# EAGLE board BasePCB (EAGLE 9.6.2)
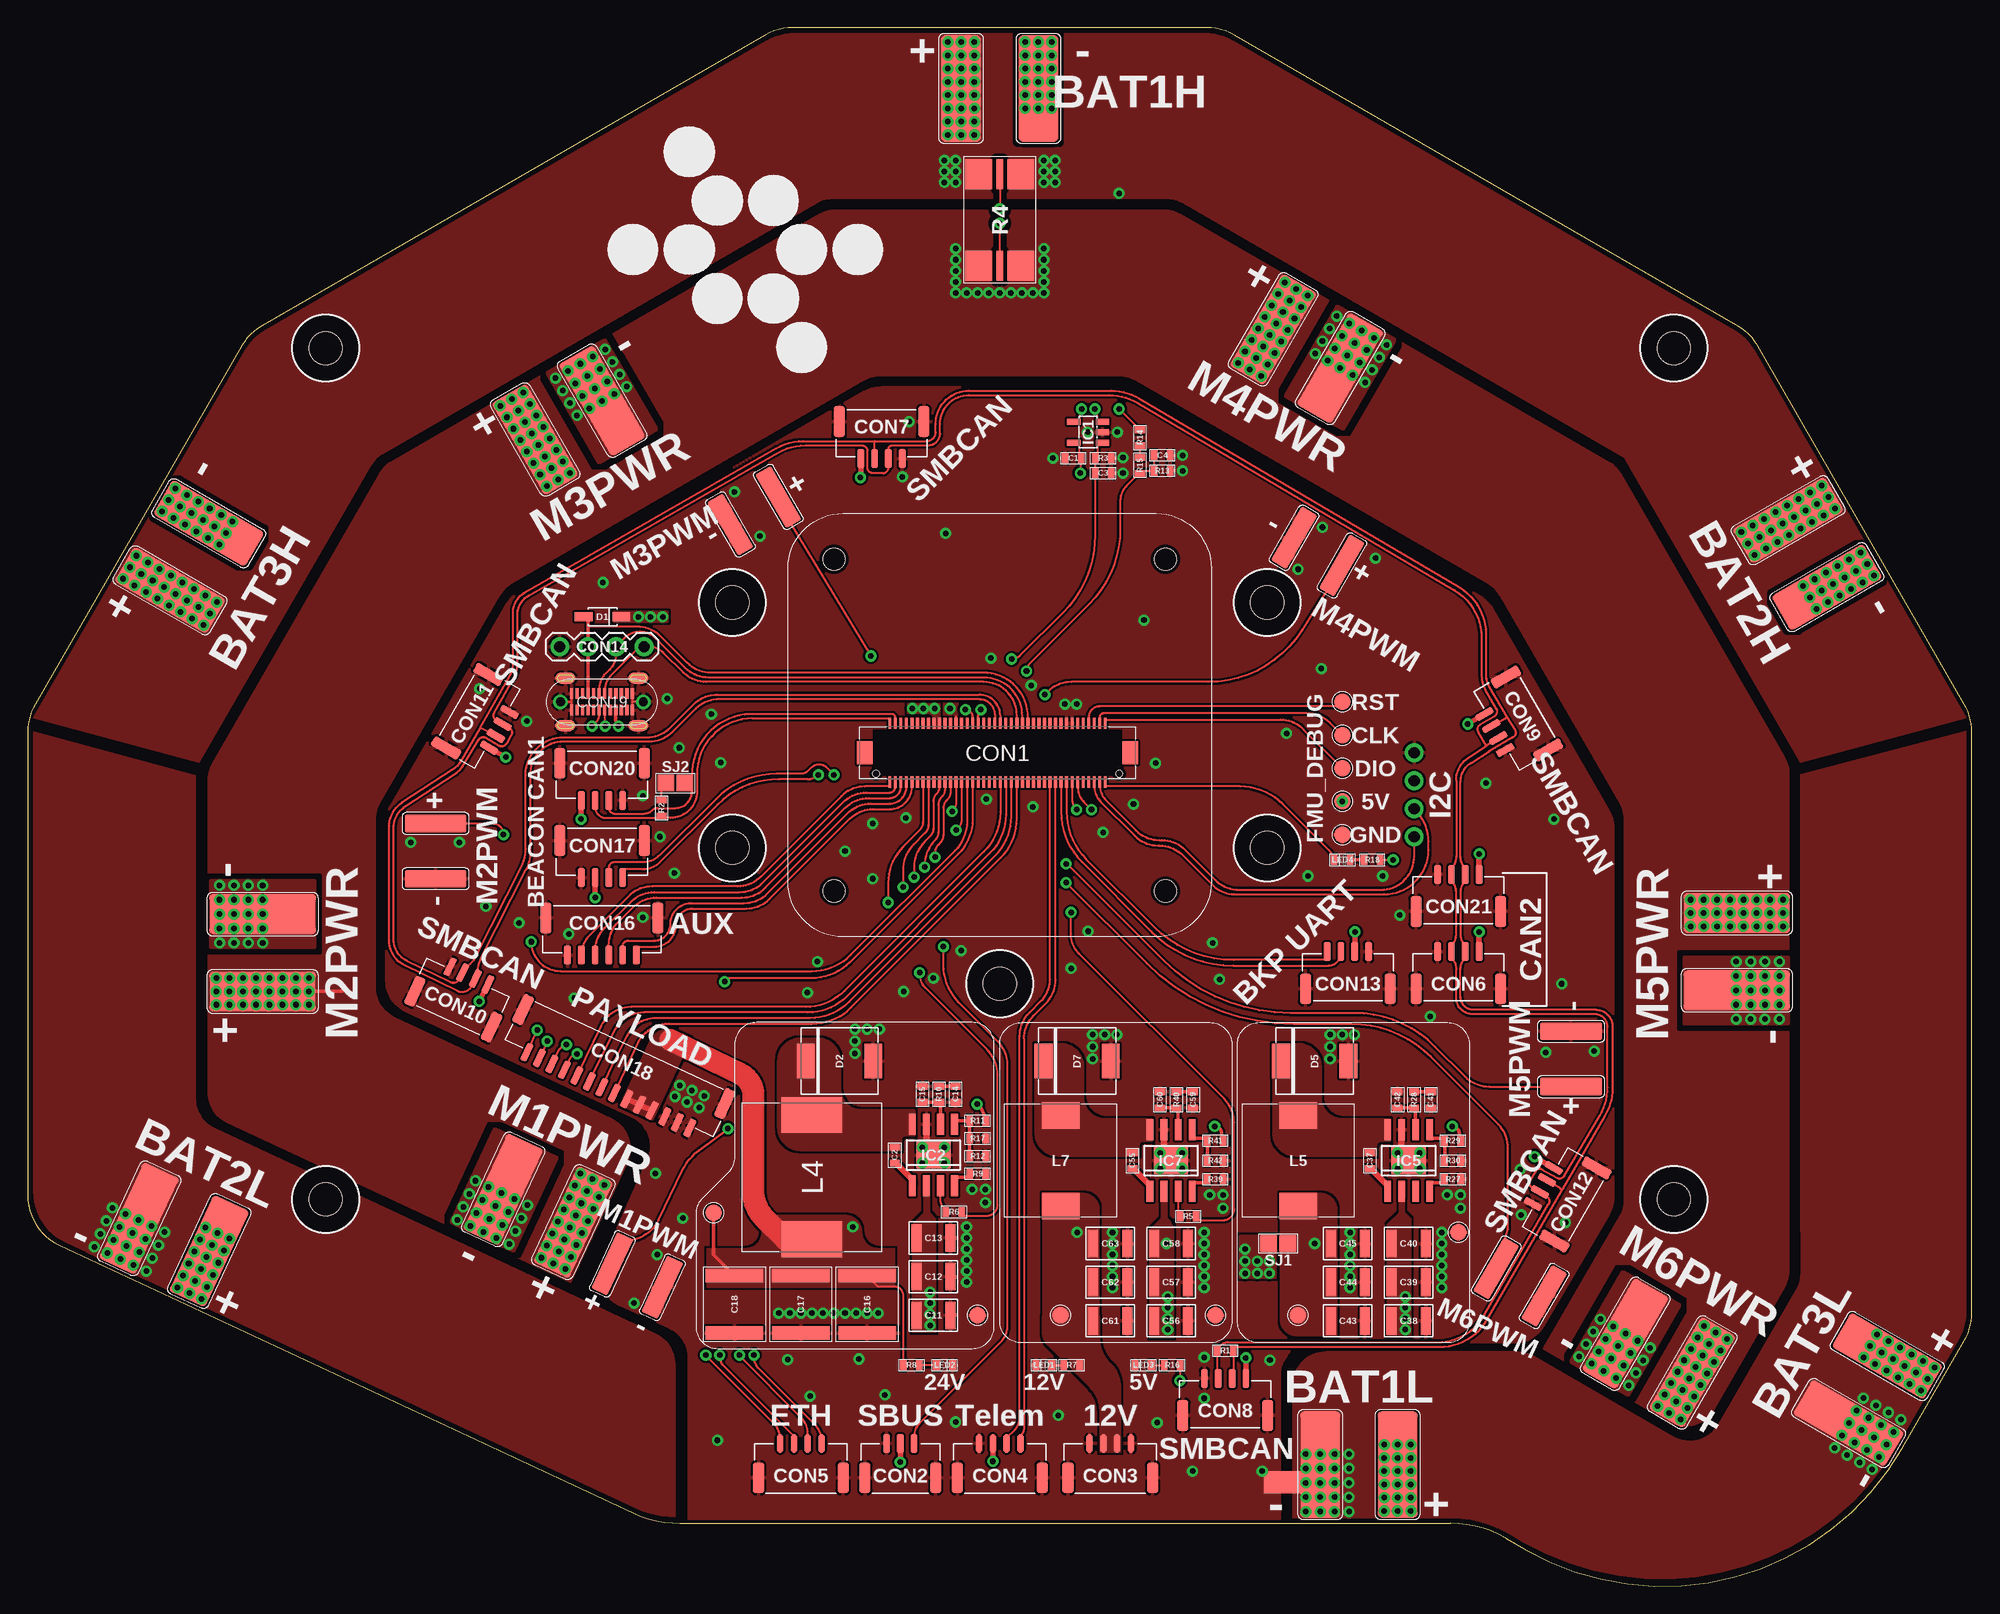
[diagram p3: board, top side]
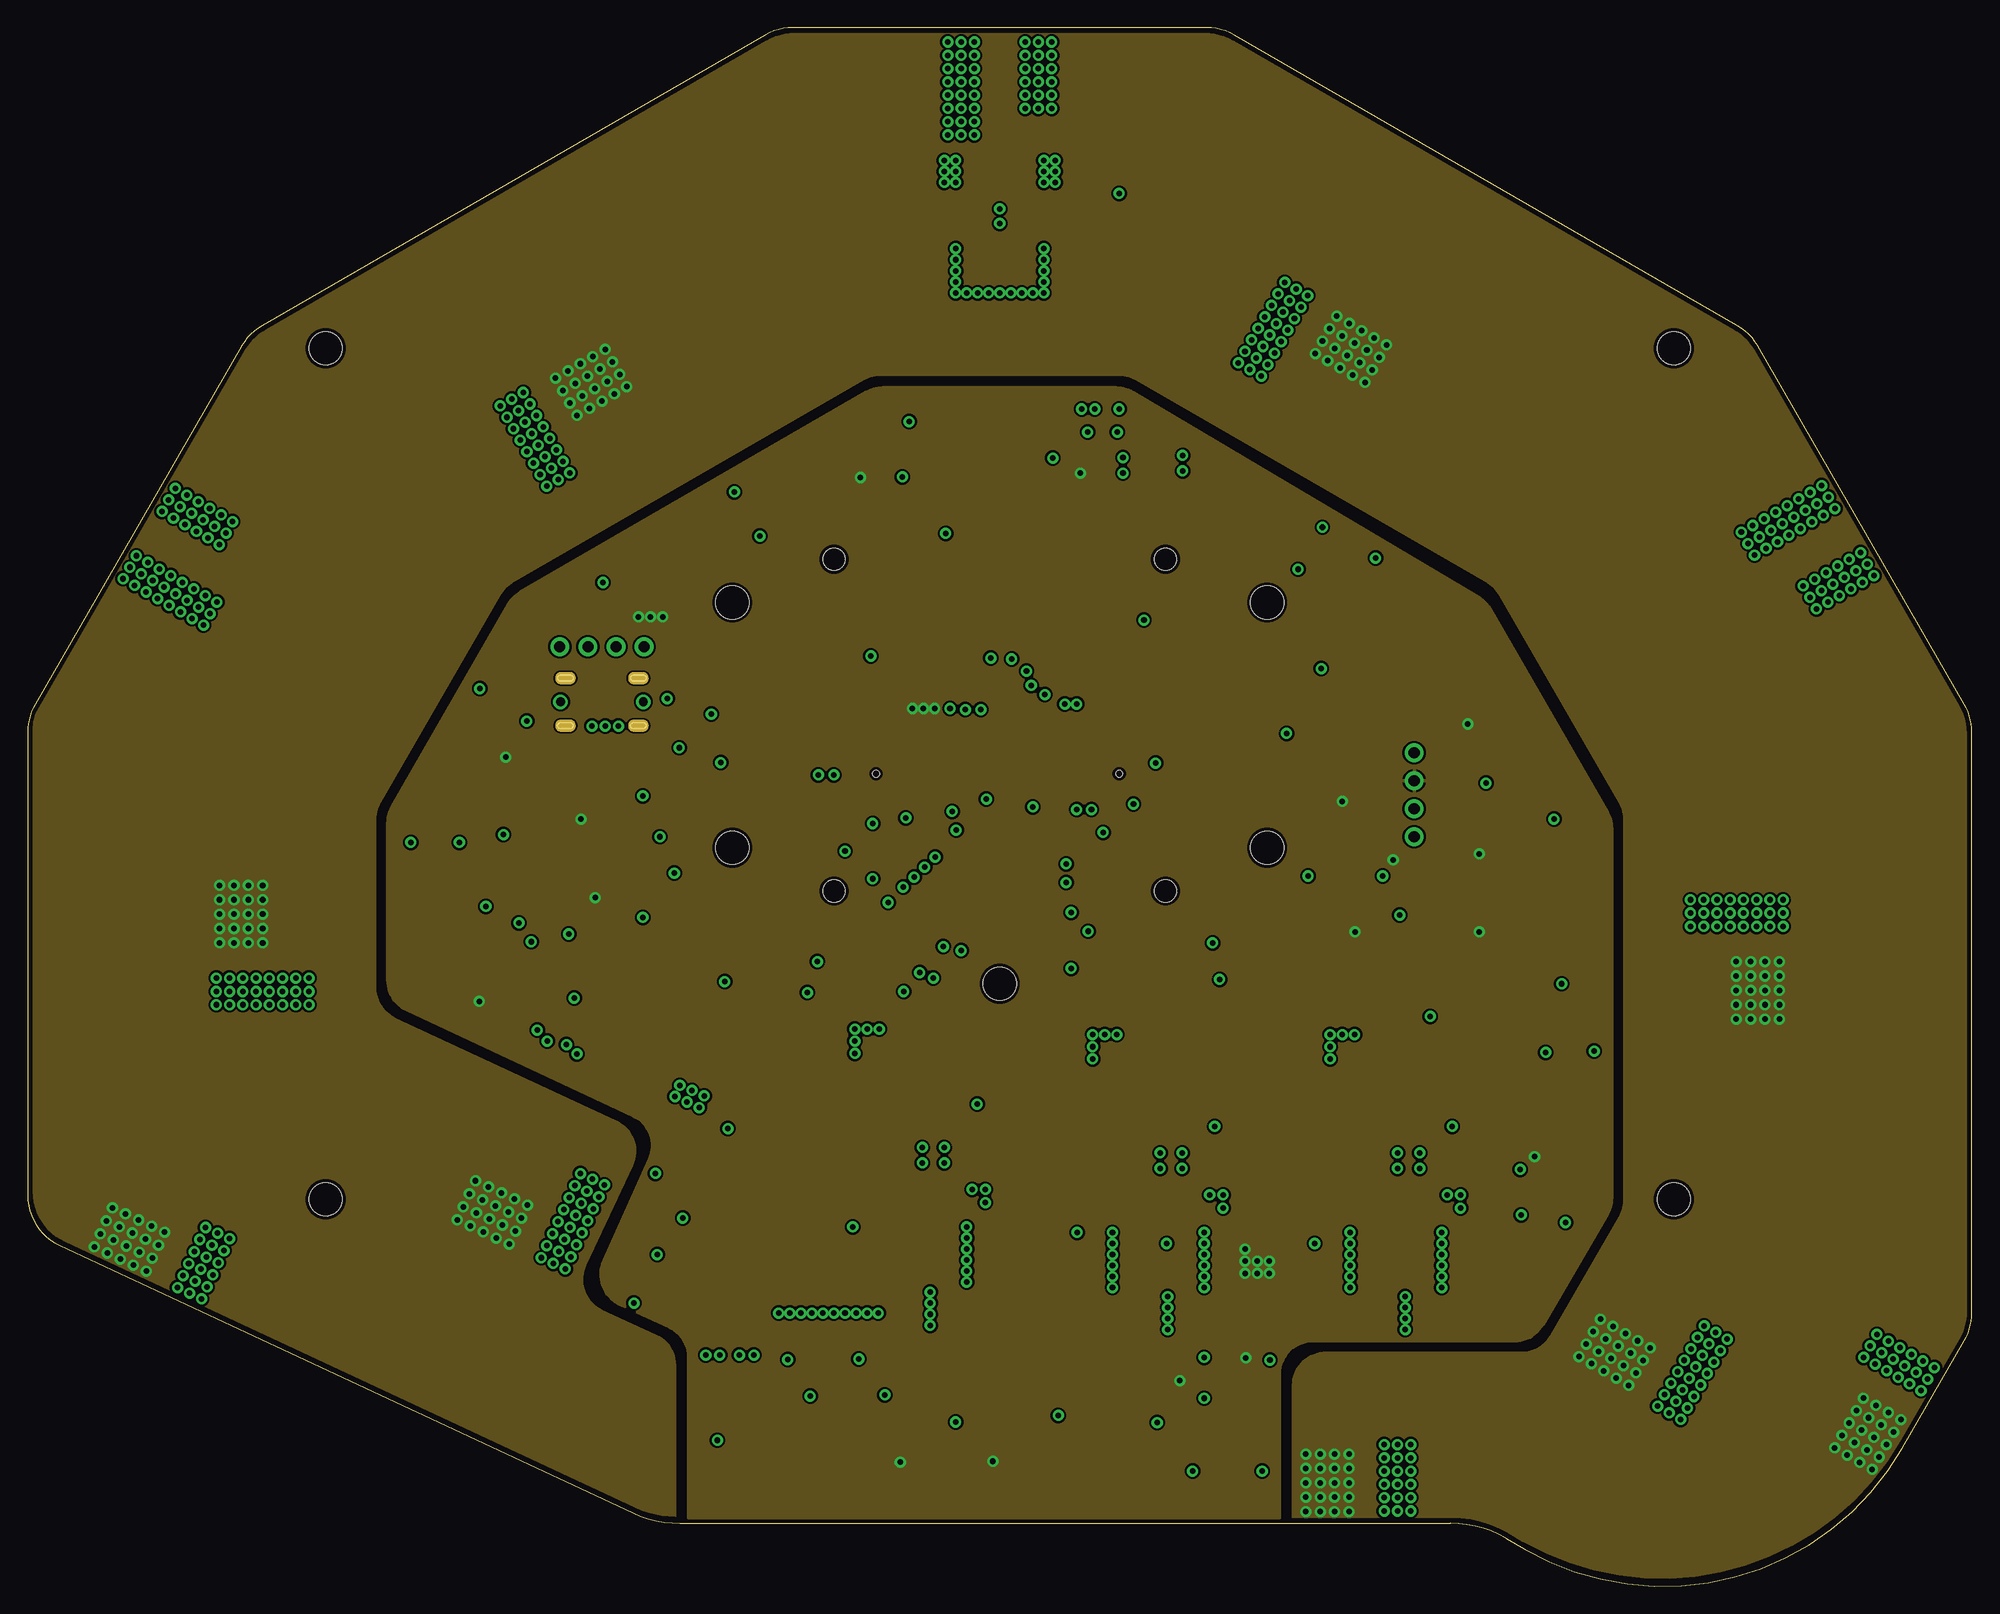
[diagram p4: board, inner layer Route2]
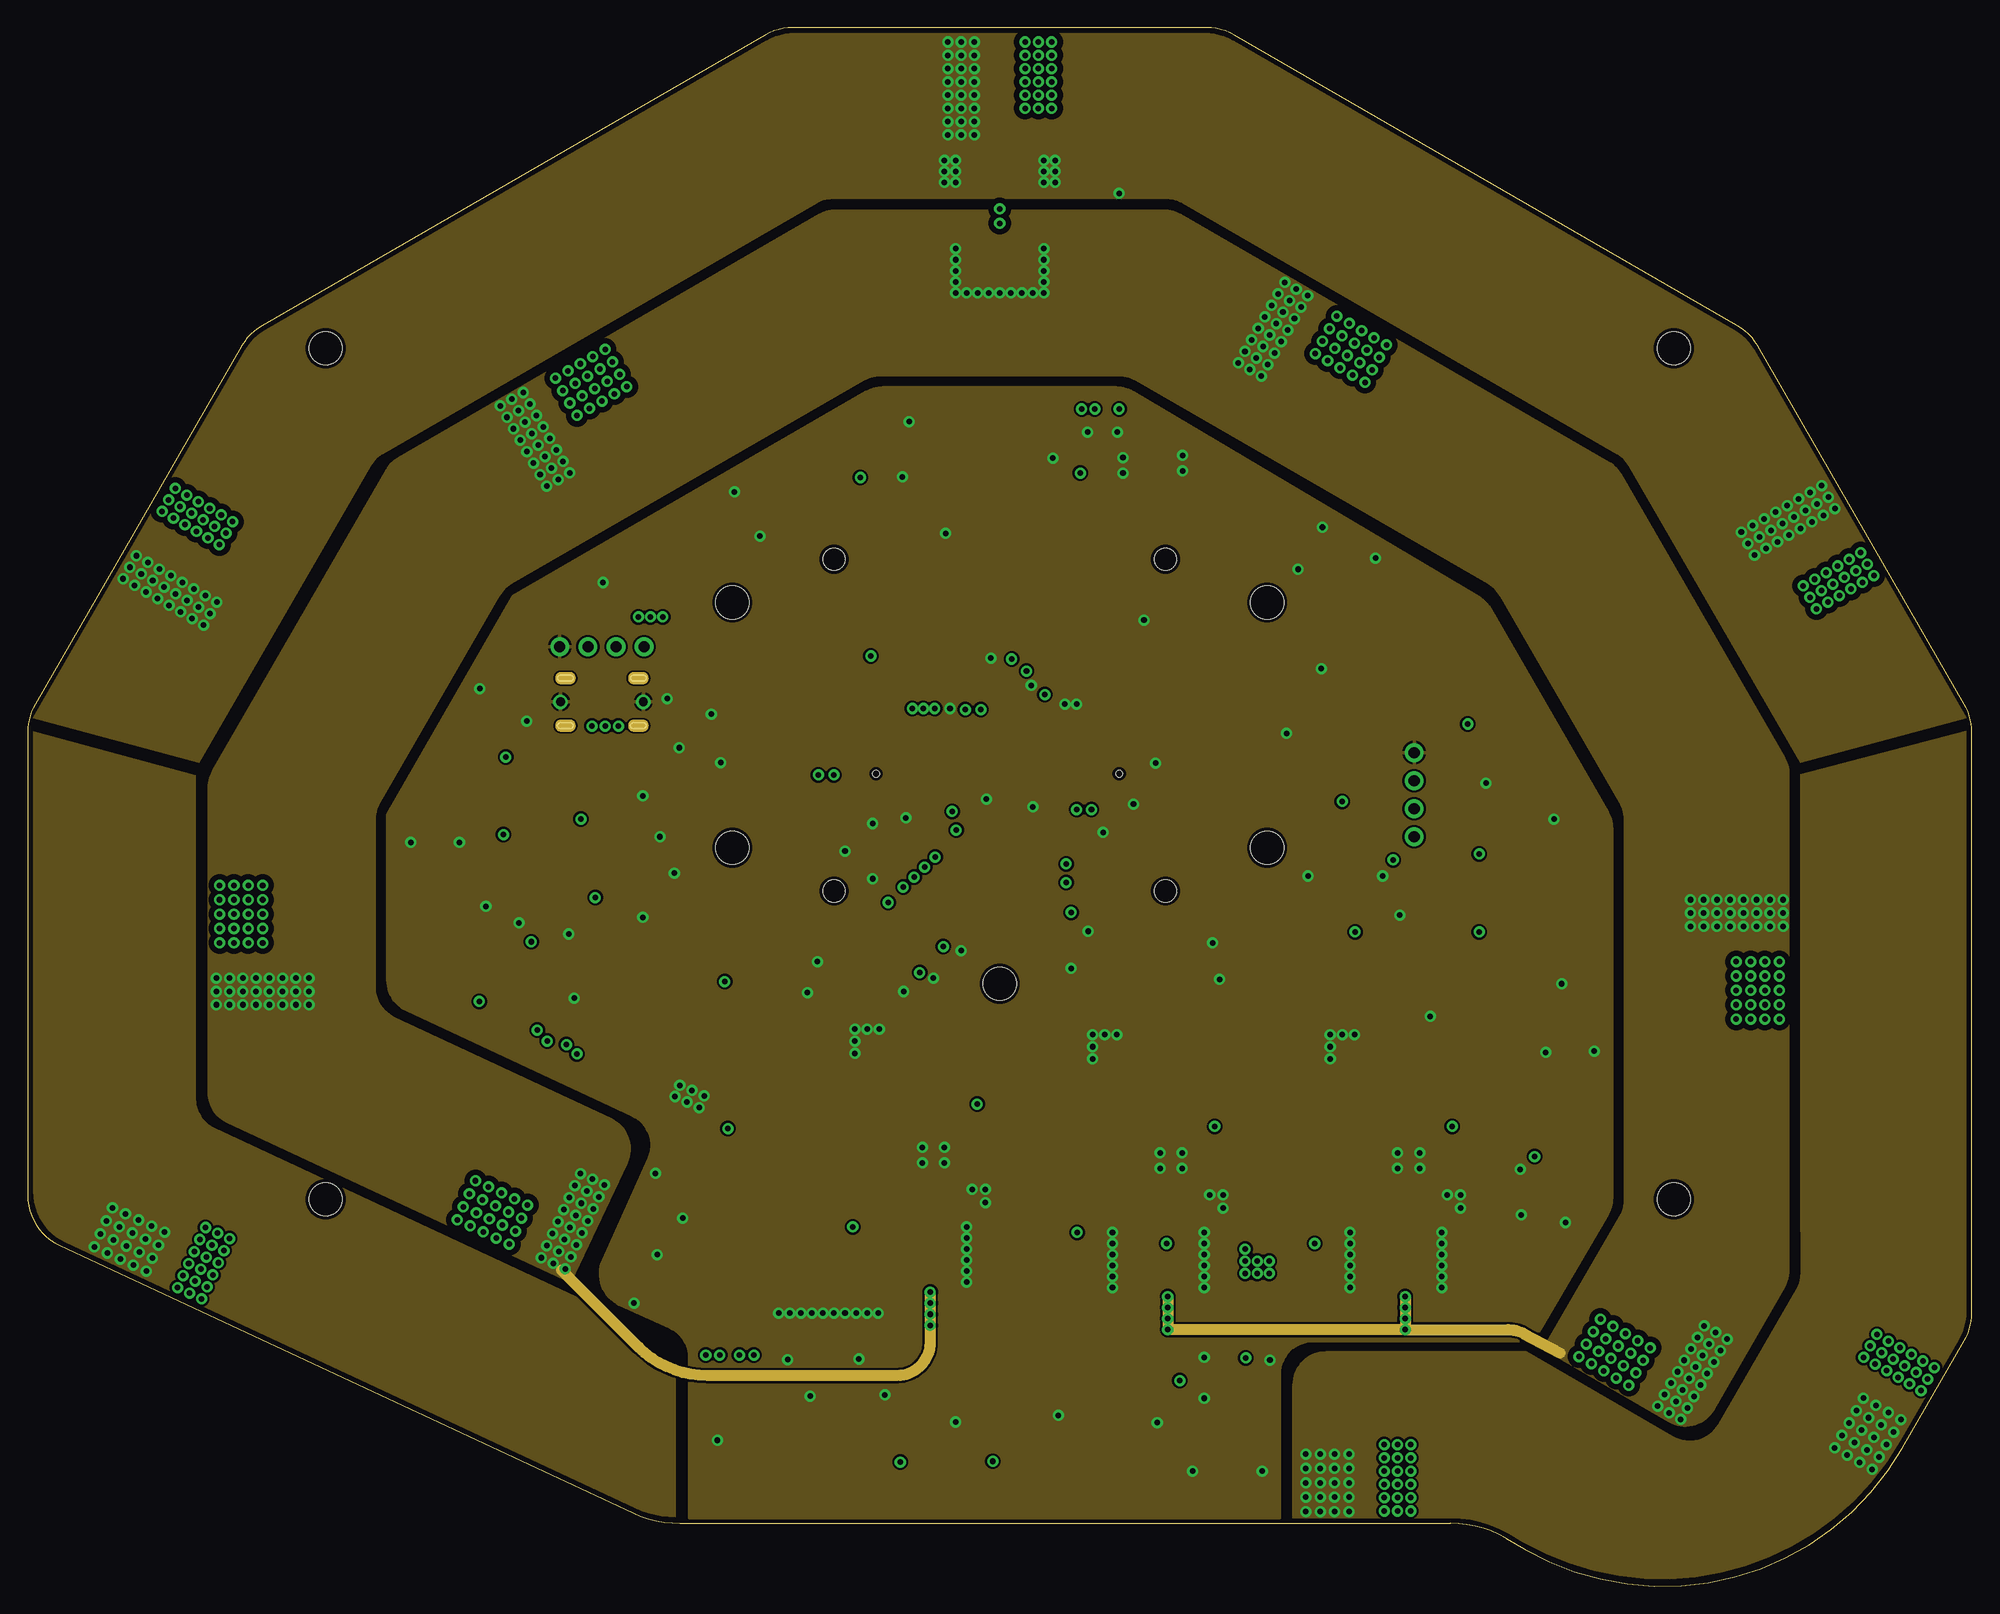
[diagram p5: board, inner layer Route3]
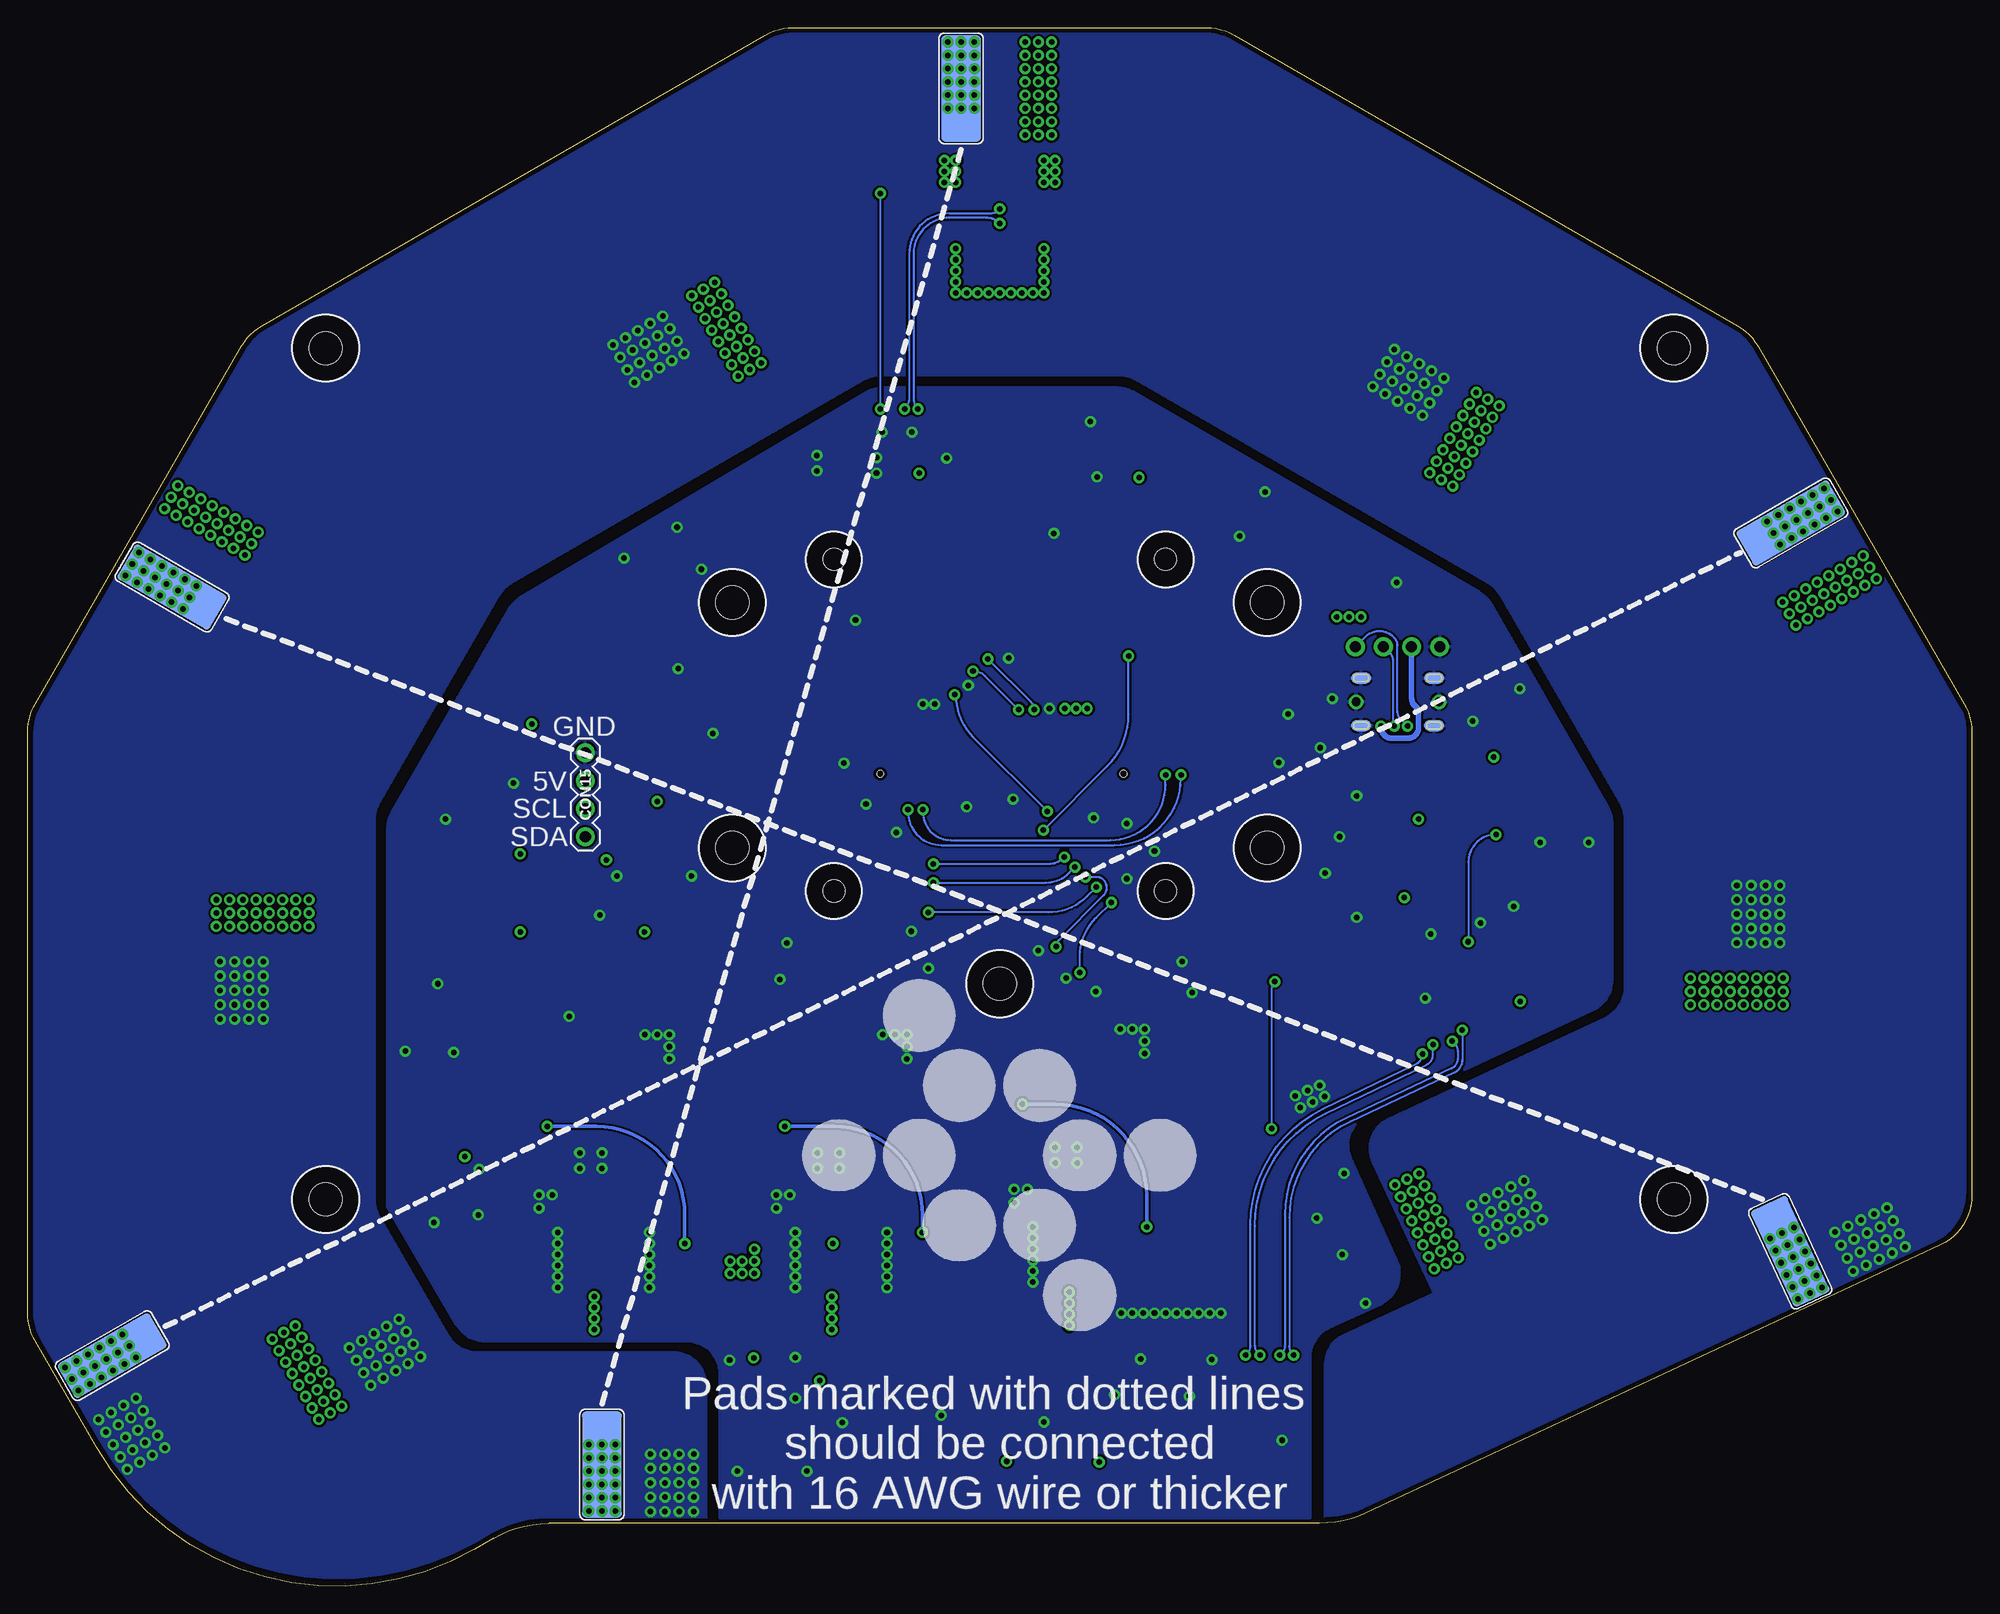
[diagram p6: board, bottom side, seen from below]

Size 175.94 x 140.99 mm. Coordinates in mm from the lower left corner, seen from the top.
Outline: 133.77,4.34 135.51,3.34 arc90 169.66,12.49 175.27,22.2 arc30 175.94,24.7 175.94,77.28 arc30 175.27,79.78 156.55,112.2 arc30 154.72,114.03 109.19,140.32 arc30 106.69,140.99 69.25,140.99 arc30 66.75,140.32 21.22,114.03 arc30 19.39,112.2 0.67,79.78 arc30 0,77.28 0,35.36 arc65 2.89,30.82 54.8,6.62 arc25 59.03,5.68 128.77,5.68 arc-30 133.77,4.34
Copper layers (1+2*3+16): Top 0.035mm / dielectric 0.12mm / Route2 0.035mm / dielectric 1.2mm / Route3 0.035mm / dielectric 0.2mm / Bottom 0.035mm
Design rules "JLCPCB 4 layer_0.2 *": minimum track width 0.2mm, minimum drill 0.2mm, track to track 0.2mm, track to pad 0.2mm, pad to pad 0.2mm, via to via 0.2mm, smd to smd 0.15mm, copper to edge 0.3mm, drill to drill 0.2mm, minimum pad ring 0.125mm, minimum via ring 0.125mm, stop-mask expansion 1mil, vias tented up to drill 0.5mm, thermal gap 8mil
Net classes: 1 HV: clearance 0.5 mm to class 0, clearance 0.5 mm
Holes 3 mm at 63.77,88.99 112.17,88.99 112.17,66.79 63.77,66.79 148.97,111.99 26.97,111.99 26.97,34.99 87.97,54.49 148.97,34.99
Holes 2 mm at 72.97,62.89 102.97,62.89 102.97,92.89 72.97,92.89
tRestrict: area 85,51.5 to 91,57.5; area 24,32 to 30,38; area 146,32 to 152,38; area 60.8,86 to 66.8,92; area 109.2,86 to 115.2,92; area 60.8,63.8 to 66.8,69.8; area 109.2,63.8 to 115.2,69.8; area 146,109 to 152,115; area 24,109 to 30,115; 3 lines
bRestrict: area 24,109 to 30,115; area 24,32 to 30,38; area 146,32 to 152,38; area 146,109 to 152,115; area 109.2,86 to 115.2,92; area 109.2,63.8 to 115.2,69.8; area 60.8,63.8 to 66.8,69.8; area 60.8,86 to 66.8,92; area 85,51.5 to 91,57.5; area 70.5,90.4 to 75.5,95.4; area 100.5,90.4 to 105.5,95.4; area 100.5,60.4 to 105.5,65.4; area 70.5,60.4 to 75.5,65.4

## Footprints (pad centres in the part's own frame; a part is rotated, then mirrored left to right if it is on the bottom)
4X10_PAIR = smd 3.6 x 9.6: 1 -3.5,0; 2 3.5,0
C0603 = smd 0.6 x 0.9: 1 -0.725,0; 2 0.725,0
C1210 = smd 0.9 x 2.5: 1 -1.55,0; 2 1.55,0
C2220 = smd 1.2 x 5.2: P$1 -2.6,0; P$2 2.6,0
DF17(1.0H)-80DP-0.5V = smd 1 x 0.25: 1 -2.65,9.75; 2 2.65,9.75; 3 -2.65,9.25; 4 2.65,9.25; 5 -2.65,8.75; 6 2.65,8.75; 7 -2.65,8.25; 8 2.65,8.25; 9 -2.65,7.75; 10 2.65,7.75; 11 -2.65,7.25; 12 2.65,7.25; 13 -2.65,6.75; 14 2.65,6.75; 15 -2.65,6.25; 16 2.65,6.25; 17 -2.65,5.75; 18 2.65,5.75; 19 -2.65,5.25; 20 2.65,5.25; 21 -2.65,4.75; 22 2.65,4.75; 23 -2.65,4.25; 24 2.65,4.25; 25 -2.65,3.75; 26 2.65,3.75; 27 -2.65,3.25; 28 2.65,3.25; 29 -2.65,2.75; 30 2.65,2.75; 31 -2.65,2.25; 32 2.65,2.25; 33 -2.65,1.75; 34 2.65,1.75; 35 -2.65,1.25; 36 2.65,1.25; 37 -2.65,0.75; 38 2.65,0.75; 39 -2.65,0.25; 40 2.65,0.25; 41 -2.65,-0.25; 42 2.65,-0.25; 43 -2.65,-0.75; 44 2.65,-0.75; 45 -2.65,-1.25; 46 2.65,-1.25; 47 -2.65,-1.75; 48 2.65,-1.75; 49 -2.65,-2.25; 50 2.65,-2.25; 51 -2.65,-2.75; 52 2.65,-2.75; 53 -2.65,-3.25; 54 2.65,-3.25; 55 -2.65,-3.75; 56 2.65,-3.75; 57 -2.65,-4.25; 58 2.65,-4.25; 59 -2.65,-4.75; 60 2.65,-4.75; 61 -2.65,-5.25; 62 2.65,-5.25; 63 -2.65,-5.75; 64 2.65,-5.75; 65 -2.65,-6.25; 66 2.65,-6.25; 67 -2.65,-6.75; 68 2.65,-6.75; 69 -2.65,-7.25; 70 2.65,-7.25; 71 -2.65,-7.75; 72 2.65,-7.75; 73 -2.65,-8.25; 74 2.65,-8.25; 75 -2.65,-8.75; 76 2.65,-8.75; 77 -2.65,-9.25; 78 2.65,-9.25; 79 -2.65,-9.75; 80 2.65,-9.75 | smd 2.1 x 1.4: P1 0,-12; P2 0,12 | hole 0.6: 1.9,-11; 1.9,11
SM03B-GHS-TB = smd 0.6 x 1.7: 1 1.25,-2.91; 2 0,-2.91; 3 -1.25,-2.91 | smd 1 x 2.8: M$0 -3.2,0.19; M$1 3.2,0.19
SM04B-GHS-TB = smd 0.6 x 1.7: 1 1.875,-2.91; 2 0.625,-2.91; 3 -0.625,-2.91; 4 -1.875,-2.91 | smd 1 x 2.8: M$0 -3.825,0.19; M$1 3.825,0.19
BM04B-GHS-TB = smd 0.6 x 1.7: 1 -1.875,-2.9; 2 -0.625,-2.9; 3 0.625,-2.9; 4 1.875,-2.9 | smd 1 x 2.8: M$0 -3.825,0.45; M$1 3.825,0.45
1X04-PTH-2.54 = drill 1 pad 1.7: 1 -3.81,0; 2 -1.27,0; 3 1.27,0; 4 3.81,0
BM06B-GHS-TBT = smd 0.6 x 1.7: 1 -3.125,-2.9; 2 -1.875,-2.9; 3 -0.625,-2.9; 4 0.625,-2.9; 5 1.875,-2.9; 6 3.125,-2.9 | smd 1 x 2.8: M$0 -5.075,0.45; M$1 5.075,0.45
BM14B-GHS-TBT = smd 0.6 x 1.7: 1 -8.125,-2.9; 2 -6.875,-2.9; 3 -5.625,-2.9; 4 -4.375,-2.9; 5 -3.125,-2.9; 6 -1.875,-2.9; 7 -0.625,-2.9; 8 0.625,-2.9; 9 1.875,-2.9; 10 3.125,-2.9; 11 4.375,-2.9; 12 5.625,-2.9; 13 6.875,-2.9; 14 8.125,-2.9 | smd 1 x 2.8: M$0 -10.075,0.45; M$1 10.075,0.45
2047110001-PROD = smd 0.3 x 0.95: A1 -2.75,0.755; A2 -2.25,0.755; A3 -1.75,0.755; A4 -1.25,0.755; A5 -0.75,0.755; A6 -0.25,0.755; A7 0.25,0.755; A8 0.75,0.755; A9 1.25,0.755; A10 1.75,0.755; A11 2.25,0.755; A12 2.75,0.755; B1 2.75,-0.755; B2 2.25,-0.755; B3 1.75,-0.755; B4 1.25,-0.755; B5 0.75,-0.755; B6 0.25,-0.755; B7 -0.25,-0.755; B8 -0.75,-0.755; B9 -1.25,-0.755; B10 -1.75,-0.755; B11 -2.25,-0.755; B12 -2.75,-0.755 | smd 1.8 x 1: G1 -3.3,2.15; G4 3.3,2.15; G7 -3.3,-2.15; G9 3.3,-2.15 | smd 1.8 x 1 bottom: G2 -3.3,2.15; G5 3.3,2.15; G8 -3.3,-2.15; G10 3.3,-2.15 | drill 0.8 pad 1.3: P$1 -3.75,0; P$2 3.75,0
SOD123 = smd 1.6 x 0.8: A -1.7,0; C 1.7,0
DO-214AB(SMC) = smd 1.6 x 3.1: A 3.05,0; C -3.05,0
SOT23-5 = smd 1.2 x 0.55: 1 1.3,-0.95; 2 1.3,0; 3 1.3,0.95; 4 -1.3,0.95; 5 -1.3,-0.95
SOIC8-POWERPAD = smd 0.6 x 1.9: 1 -1.905,-2.78; 2 -0.635,-2.78; 3 0.635,-2.78; 4 1.905,-2.78; 5 1.905,2.78; 6 0.635,2.78; 7 -0.635,2.78; 8 -1.905,2.78 | smd 3.1 x 2.4: P$1 0,0
CONNECTION_BIG = smd 2 x 2: 1 -1,0; 2 1,0
MWSA1206S = smd 3.25 x 5.5: 1 -5.625,0; 2 5.625,0
1064 = smd 3.4 x 2.4: 1 0,-4.1; 2 0,4.1
LED0603 = smd 0.6 x 0.9: A 0.725,0; C -0.725,0
10X4 = smd 3.6 x 9.6: P$1 0,0
2х2 = smd 1.5 x 1.5: P$1 0,0
2X6_PAIR = smd 1.6 x 5.6: 1 -2.5,0; 2 2.5,0
R0603 = smd 0.6 x 0.9: 1 -0.725,0; 2 0.725,0
R3920-KELVIN = smd 2.7 x 2.4: 1 -4.15,1.9; 2 4.15,1.9; 11 -4.15,-1.9; 22 4.15,-1.9 | smd 2.7 x 0.6: S1 -4.15,0; S2 4.15,0
RES_0 = smd 1.5 x 1.5: 1 -0.85,0; 2 0.85,0

## Placement (x,y rotation side)
BAT1PAD1  PAD_PAIR-4X10  [4X10_PAIR]  87.97,135.49 0 top
BAT1PAD2  PAD_PAIR-4X10  [4X10_PAIR]  120.47,10.99 180 top
BAT2PAD1  PAD_PAIR-4X10  [4X10_PAIR]  161.06,93.4 300 top
BAT2PAD2  PAD_PAIR-4X10  [4X10_PAIR]  13.27,31.79 155 top
BAT3PAD1  PAD_PAIR-4X10  [4X10_PAIR]  14.64,93.12 60 top
BAT3PAD2  PAD_PAIR-4X10  [4X10_PAIR]  166.53,17.78 240 top
C1  0.1uF  [C0603]  94.62,102.04 0 top
C2  0.1uF  [C0603]  78.47,38.99 90 top
C3  DNP  [C0603]  97.32,100.69 180 top
C4  DNP  [C0603]  102.67,102.29 180 top
C11  2.2uF  [C1210]  81.97,24.49 180 top
C12  2.2uF  [C1210]  81.97,27.99 180 top
C13  2.2uF  [C1210]  81.97,31.49 180 top
C14  4700pF  [C0603]  83.97,44.49 90 top
C15  47pF  [C0603]  80.97,44.49 270 top
C16  22uF  [C2220]  75.97,25.49 90 top
C17  22uF  [C2220]  69.97,25.49 90 top
C18  22uF  [C2220]  63.97,25.49 90 top
C37  0.1uF  [C0603]  121.47,38.49 90 top
C38  2.2uF  [C1210]  124.97,23.99 180 top
C39  2.2uF  [C1210]  124.97,27.49 180 top
C40  2.2uF  [C1210]  124.97,30.99 180 top
C41  4700pF  [C0603]  126.97,43.99 90 top
C42  47pF  [C0603]  123.97,43.99 270 top
C43  47uF  [C1210]  119.47,23.99 180 top
C44  47uF  [C1210]  119.47,27.49 180 top
C45  47uF  [C1210]  119.47,30.99 180 top
C55  0.1uF  [C0603]  99.97,38.49 90 top
C56  2.2uF  [C1210]  103.47,23.99 180 top
C57  2.2uF  [C1210]  103.47,27.49 180 top
C58  2.2uF  [C1210]  103.47,30.99 180 top
C59  4700pF  [C0603]  105.47,43.99 90 top
C60  47pF  [C0603]  102.47,43.99 270 top
C61  47uF  [C1210]  97.97,23.99 180 top
C62  47uF  [C1210]  97.97,27.49 180 top
C63  47uF  [C1210]  97.97,30.99 180 top
CON1  CON-80P-DF17(1.0H)-80DP-0.5V  [DF17(1.0H)-80DP-0.5V]  87.77,75.39 270 top
CON2  CON-3P-TABS-JST-GH-SIDE  [SM03B-GHS-TB]  78.97,9.99 180 top
CON3  CON-4P-TABS-JST-GH-SIDE  [SM04B-GHS-TB]  97.97,9.99 180 top
CON4  CON-4P-TABS-JST-GH-SIDE  [SM04B-GHS-TB]  87.97,9.99 180 top
CON5  CON-4P-TABS-JST-GH-SIDE  [SM04B-GHS-TB]  69.97,9.99 180 top
CON6  CON-4P-TABS-JST-GH-TOP  [BM04B-GHS-TB]  129.47,54.49 180 top
CON7  CON-4P-TABS-JST-GH-TOP  [BM04B-GHS-TB]  77.27,104.89 0 top
CON8  CON-4P-TABS-JST-GH-TOP  [BM04B-GHS-TB]  108.37,15.89 180 top
CON9  CON-4P-TABS-JST-GH-TOP  [BM04B-GHS-TB]  135.29,78.71 300 top
CON10  CON-4P-TABS-JST-GH-TOP  [BM04B-GHS-TB]  38.71,52.61 155 top
CON11  CON-4P-TABS-JST-GH-TOP  [BM04B-GHS-TB]  40.17,78.92 60 top
CON12  CON-4P-TABS-JST-GH-TOP  [BM04B-GHS-TB]  139.67,34.74 240 top
CON13  CON-4P-TABS-JST-GH-TOP  [BM04B-GHS-TB]  119.47,54.49 180 top
CON14  PINHEAD_1X04-2.54  [1X04-PTH-2.54]  51.97,84.99 0 top
CON15  PINHEAD_1X04-2.54  [1X04-PTH-2.54]  125.47,71.59 270 bottom
CON16  CON-6P-TABS-JST-GH-TOP  [BM06B-GHS-TBT]  51.97,59.99 0 top
CON17  CON-4P-TABS-JST-GH-TOP  [BM04B-GHS-TB]  51.97,66.99 0 top
CON18  CON-14P-TABS-JST-GH-TOP  [BM14B-GHS-TBT]  53.77,47.49 335 top
CON19  USB-TYPE-C-VERT-PROD  [2047110001-PROD]  51.97,79.99 0 top
CON20  CON-4P-TABS-JST-GH-TOP  [BM04B-GHS-TB]  51.97,73.99 0 top
CON21  CON-4P-TABS-JST-GH-TOP  [BM04B-GHS-TB]  129.47,61.49 180 top
D1  MBR0520L-SOD123  [SOD123]  52.02,87.69 0 top
D2  B560C  [DO-214AB(SMC)]  73.47,47.49 0 top
D5  B560C  [DO-214AB(SMC)]  116.47,47.49 0 top
D7  B560C  [DO-214AB(SMC)]  94.97,47.49 0 top
IC1  INA169  [SOT23-5]  95.97,104.39 0 top
IC2  TPS54560B  [SOIC8-POWERPAD]  81.97,38.99 0 top
IC5  TPS54560B  [SOIC8-POWERPAD]  124.97,38.49 0 top
IC7  TPS54560B  [SOIC8-POWERPAD]  103.47,38.49 0 top
J1  CONNECTION-SMD-BIG  [CONNECTION_BIG]  113.87,9.39 0 top
L4  22µH  [MWSA1206S]  70.97,36.99 270 top
L5  7.2uH  [1064]  114.97,38.49 180 top
L7  7.2uH  [1064]  93.47,38.49 180 top
LED1  LED-0603  [LED0603]  91.97,19.99 0 top
LED2  LED-0603  [LED0603]  82.97,19.99 180 top
LED3  LED-0603  [LED0603]  100.97,19.99 0 top
LED4  LED-0603  [LED0603]  118.97,65.69 0 top
M1  PAD_PAIR-4X10  [4X10_PAIR]  46.21,34.41 155 top
M2  PAD_PAIR-4X10  [4X10_PAIR]  21.27,57.29 90 top
M3  PAD_PAIR-4X10  [4X10_PAIR]  48.96,105.49 30 top
M4  PAD_PAIR-4X10  [4X10_PAIR]  115.74,111.94 330 top
M5  PAD_PAIR-4X10  [4X10_PAIR]  154.67,57.39 270 top
M6  PAD_PAIR-4X10  [4X10_PAIR]  147.61,21.08 150 top
PAD1  PAD-10X4  [10X4]  91.47,135.49 0 bottom
PAD2  PAD-10X4  [10X4]  16.44,30.28 205 bottom
PAD3  PAD-S_2X2  [2х2]  118.97,70.99 0 top
PAD4  PAD-S_2X2  [2х2]  118.97,67.99 0 top
PAD5  PAD-10X4  [10X4]  162.86,90.38 240 bottom
PAD6  PAD-10X4  [10X4]  168.28,20.84 300 bottom
PAD7  PAD-10X4  [10X4]  123.97,10.99 180 bottom
PAD10  PAD-10X4  [10X4]  16.39,96.18 300 bottom
PAD13  PAD-S_2X2  [2х2]  129.47,31.99 90 top
PAD14  PAD-S_2X2  [2х2]  114.97,24.49 90 top
PAD15  PAD-S_2X2  [2х2]  93.47,24.49 90 top
PAD16  PAD-S_2X2  [2х2]  107.47,24.49 180 top
PAD17  PAD-S_2X2  [2х2]  62.07,33.79 180 top
PAD18  PAD-S_2X2  [2х2]  85.97,24.49 90 top
PAD25  PAD-S_2X2  [2х2]  118.97,76.99 180 top
PAD26  PAD-S_2X2  [2х2]  118.97,73.99 180 top
PAD27  PAD-S_2X2  [2х2]  118.97,79.99 180 top
PAD28  PAD_PAIR-2X6  [2X6_PAIR]  55.17,28.09 155 top
PAD29  PAD_PAIR-2X6  [2X6_PAIR]  36.92,66.49 90 top
PAD30  PAD_PAIR-2X6  [2X6_PAIR]  65.77,97.29 30 top
PAD31  PAD_PAIR-2X6  [2X6_PAIR]  116.77,93.59 330 top
PAD32  PAD_PAIR-2X6  [2X6_PAIR]  139.67,47.69 270 top
PAD33  PAD_PAIR-2X6  [2X6_PAIR]  135.07,27.49 150 top
R1  120R  [R0603]  108.37,21.29 180 top
R2  120R  [R0603]  57.37,70.39 90 top
R3  82K  [R0603]  97.32,102.04 180 top
R4  200 µOhms  [R3920-KELVIN]  87.97,123.59 270 top
R5  DNP  [R0603]  105.02,33.44 180 top
R6  DNP  [R0603]  83.82,33.84 180 top
R7  3K3  [R0603]  94.47,19.99 180 top
R8  7K5  [R0603]  79.97,19.99 0 top
R9  243K  [R0603]  85.97,37.29 180 top
R10  16K  [R0603]  82.47,44.49 270 top
R11  143K  [R0603]  85.97,42.09 0 top
R12  10K2  [R0603]  85.97,38.89 180 top
R13  10K2  [R0603]  102.67,100.89 180 top
R14  82K  [R0603]  100.67,103.89 90 top
R15  82K  [R0603]  100.67,101.39 90 top
R16  1K  [R0603]  103.57,19.99 180 top
R17  10K2  [R0603]  85.97,40.49 180 top
R18  1K  [R0603]  121.67,65.69 180 top
R27  243K  [R0603]  128.97,36.79 180 top
R28  16K  [R0603]  125.47,43.99 270 top
R29  53K6  [R0603]  128.97,40.29 0 top
R30  10K2  [R0603]  128.97,38.49 180 top
R39  243K  [R0603]  107.47,36.79 180 top
R40  16K  [R0603]  103.97,43.99 270 top
R41  143K  [R0603]  107.47,40.29 0 top
R42  10K2  [R0603]  107.47,38.49 180 top
SJ1  [RES_0]  113.17,30.99 180 top
SJ2  [RES_0]  58.62,72.64 0 top
U$1  [AERODYNE]  87.97,38.99 0 bottom
U$2  [AERODYNE_SMALL]  64.97,120.99 0 top

## Tracks (layer width: path | path; a pad name or v marks a point on that pad's centre or on a via)
!FMU_LED_AMBER
  Top 0.2: CON1.2 97.52,72.34 109.72,72.34 arc-45 113.6,70.74 117.76,66.57 arc-45 118.05,65.89 LED4.C
BAT1_MID  (via drill 0.5 pad 1)
  other vias: 122.77,12.79 123.97,12.79 125.17,12.79 122.77,11.59 123.97,11.59 125.17,11.59 122.77,10.39 123.97,10.39 125.17,10.39 122.77,9.19 123.97,9.19 125.17,9.19 122.77,7.99 123.97,7.99 125.17,7.99 122.77,6.79 123.97,6.79 125.17,6.79
  pour Top (no thermals): 125.67,15.39 125.67,6.59 arc-90 125.37,6.29 122.57,6.29 arc-90 122.27,6.59 122.27,15.59 arc-90 122.37,15.69 125.37,15.69 arc-90
  pour Bottom (no thermals): 125.67,15.39 125.67,6.59 arc-90 125.37,6.29 122.57,6.29 arc-90 122.27,6.59 122.27,15.39 arc-90 122.57,15.69 125.37,15.69 arc-90
BAT2_MID  (via drill 0.5 pad 1)
  other vias: 16.1,32.44 17.19,31.93 18.27,31.42 15.59,31.35 16.68,30.84 17.77,30.34 15.08,30.26 16.17,29.76 17.26,29.25 14.58,29.18 15.66,28.67 16.75,28.16 14.07,28.09 15.16,27.58 16.24,27.07 13.56,27 14.65,26.49 15.74,25.99
  pour Top (no thermals): 19.82,33.57 16.11,25.59 arc-90 15.71,25.45 13.17,26.63 arc-90 13.02,27.03 16.74,35.01 arc-90 17.14,35.15 19.68,33.97 arc-90
  pour Bottom (no thermals): 19.82,33.57 16.11,25.59 arc-90 15.71,25.45 13.17,26.63 arc-90 13.02,27.03 16.74,35.01 arc-90 17.14,35.15 19.68,33.97 arc-90
BAT3_MID  (via drill 0.5 pad 1)
  other vias: 166.14,20.69 166.74,21.72 167.34,22.76 167.18,20.09 167.78,21.12 168.38,22.16 168.22,19.49 168.82,20.52 169.42,21.56 169.26,18.89 169.86,19.92 170.46,20.96 170.3,18.29 170.9,19.32 171.5,20.36 171.34,17.69 171.94,18.72 172.54,19.76
  pour Top (no thermals): 165.34,24.5 172.96,20.1 arc-90 173.07,19.69 171.67,17.26 arc-90 171.26,17.15 163.64,21.55 arc-90 163.53,21.96 164.93,24.39 arc-90
  pour Bottom (no thermals): 165.34,24.5 172.96,20.1 arc-90 173.07,19.69 171.67,17.26 arc-90 171.26,17.15 163.64,21.55 arc-90 163.53,21.96 164.93,24.39 arc-90
BATT_CURRENT_SENS_PROT  (via drill 0.5 pad 1)
  Top 0.2: IC1.1 96.97,103.44 96.8,103.27 96.8,102.24 R3.2 C3.2 96.6,95.11 arc-45 93.67,88.05 89.81,84.19 arc-45 v89.04,83.87 | CON1.49 85.52,78.64 arc90 v84.87,79.29
  Bottom 0.2: v89.04,83.87 85.16,79.99 arc45 v84.87,79.29
BATT_VOLTAGE_SENS_PROT  (via drill 0.5 pad 1)
  Top 0.2: C4.2 R13.2 100.9,100.89 R15.1 100.57,100.67 99.46,99.55 arc45 98.87,98.14 98.87,95.63 arc-45 96.05,88.84 90.67,83.45 arc45 v90.39,82.77 | CON1.47 86.02,78.69 arc-45 v86.27,79.29
  Bottom 0.2: v86.27,79.29 89.3,82.32 arc-45 v90.39,82.77
CAN1_H
  Top 0.2: CON1.79 78.02,78.49 65.57,78.49 arc90 60.57,73.49 60.57,71.89 arc-90 58.17,69.49 57.2,69.49 | CON20.2 51.35,70.49 arc90 52.35,69.49 57.2,69.49 | 57.2,69.49 R2.1
CAN1_L
  Top 0.2: CON1.77 78.52,78.59 arc90 78.22,78.89 65.42,78.89 arc90 60.12,73.29 60.12,72.64 | CON20.3 52.6,70.39 arc90 53.1,69.89 55.81,69.89 arc45 56.51,70.18 arc-45 57.01,70.39 58.62,70.39 arc90 60.12,71.89 60.12,72.64 | 60.12,72.64 SJ2.2
CAN2_H
  Top 0.2: CON1.41 87.52,78.84 arc90 86.12,80.24 62.59,80.24 arc45 60.47,79.36 58.37,77.27 arc-45 56.25,76.39 48.47,76.39 arc90 45.47,73.39 45.47,66.3 arc-27 45.12,64.83 41.03,56.83 arc27 40.7,55.47 40.7,55.17 CON10.2 40.22,54.35 arc-92 38.87,53.85 34.13,56.16 arc-64 32.72,58.41 32.72,68.76 arc-57 33.85,70.85 38.5,73.9 arc26 39.12,74.54 40.97,77.64 | 76.65,103.59 70.21,103.59 arc30 67.73,102.93 45.03,89.93 arc60 43.92,88.02 43.92,83.37 arc-30 43.66,82.39 40.97,77.64 | CON7.2 76.65,103.59 | 76.65,103.59 81.37,103.59 arc90 82.17,104.39 82.17,105.14 arc-90 85.17,108.14 98.04,108.14 arc-31 100.58,107.45 129.51,90.39 arc-59 131.97,86.09 131.97,82.38 arc30 132.24,81.37 133.85,78.61 | CON11.2 40.97,77.64 | CON9.2 133.85,78.61 | 133.85,78.61 134.58,77.48 arc-93 134.41,76.78 132.27,75.54 130.58,74.45 arc57 129.67,72.77 129.67,65.96 arc45 130.07,64.99 130.07,64.42 CON21.2 130.1,63.82 arc45 129.67,62.79 129.67,58.94 arc45 130.1,57.92 CON6.2 130.1,56.84 arc45 129.67,55.82 129.67,53.29 arc90 130.82,52.14 141.92,52.14 arc-90 143.42,50.64 143.42,45.07 arc-30 142.75,42.56 138.88,35.88 | CON8.2 109,19.39 109.1,19.49 R1.1 109.1,21.59 109.15,21.64 127.78,21.64 arc60 132.11,24.14 138.87,35.86 138.88,35.88 | CON12.2 137.49,36.73 138.63,36.02 138.66,36 138.87,35.87 138.88,35.88
CAN2_L
  Top 0.2: CON1.39 88.02,78.74 arc90 86.12,80.64 62.36,80.64 arc45 60.24,79.76 58.15,77.67 arc-45 56.03,76.79 48.47,76.79 arc90 45.07,73.39 45.07,66.68 arc-27 44.7,65.11 40.6,57.05 arc-18 40.05,56.28 39.37,55.6 CON10.3 39.31,55.36 39.15,55.01 arc-93 38.2,54.66 34.33,56.55 arc-64 33.12,58.49 33.12,68.59 arc-57 34.18,70.55 38.7,73.51 arc26 39.48,74.32 40.81,76.56 arc-90 41.5,76.73 42.64,76.05 arc90 43.33,76.22 43.77,76.96 arc90 43.6,77.65 CON11.3 42.43,78.3 arc-92 42.22,78.99 44,82.13 arc29 44.32,83.36 44.32,87.87 arc-60 45.33,89.6 67.9,102.53 arc-30 70.39,103.19 75.5,103.19 arc-90 76,102.69 76,101.19 arc90 76.5,100.69 77.4,100.69 arc90 77.9,101.19 CON7.3 77.9,102.84 arc-90 78.25,103.19 81.47,103.19 arc90 82.57,104.29 82.57,105.14 arc-90 85.17,107.74 97.88,107.74 arc-31 100.42,107.05 129.11,90.09 arc-59 131.57,85.79 131.57,82.37 arc30 131.91,81.11 132.92,79.37 arc-90 132.74,78.69 131.46,77.95 arc91 131.28,77.26 132.02,76.04 | CON9.3 132.02,76.04 | 132.02,76.04 130.38,74.94 arc56 129.27,72.87 129.27,65.99 arc-45 128.85,64.97 CON21.3 128.85,63.82 arc-45 129.27,62.79 129.27,58.94 arc-45 128.85,57.92 CON6.3 128.85,56.84 arc-45 129.27,55.82 129.27,53.24 arc90 130.77,51.74 141.82,51.74 arc-90 142.97,50.59 142.97,45.1 arc-30 142.28,42.57 139.07,37.11 arc-89 138.39,36.93 137,37.72 arc89 136.51,37.59 135.94,36.61 arc90 136.06,36.12 CON12.3 137.43,35.3 arc-90 137.63,34.53 131.84,24.54 arc-60 127.52,22.04 108.63,22.04 arc45 107.93,21.75 107.65,21.47 R1.2 107.65,18.89 CON8.3
ETH_RX+  (via drill 0.5 pad 1)
  Top 0.2: v47.02,49.29 46.99,49.26 CON18.2 | CON5.2 69.35,13.55 63.06,19.84 arc-45 v62.62,20.89
  Bottom 0.2: v47.02,49.29 46.81,49.08 arc45 46.52,48.38 46.52,47.73 arc65 47.1,46.83 56.64,42.34 arc-65 62.17,33.63 62.17,21.76 arc45 62.46,21.05 v62.62,20.89
ETH_RX-  (via drill 0.5 pad 1)
  Top 0.2: CON18.1 46.07,50.25 v46.12,50.29 | CON5.1 68.1,13.34 arc45 67.51,14.75 v61.37,20.89
  Bottom 0.2: v46.12,50.29 46.12,47.61 arc65 46.88,46.42 56.25,42.03 arc-65 61.77,33.35 61.77,21.71 arc-45 61.48,21 v61.37,20.89
ETH_TX+  (via drill 0.5 pad 1)
  Top 0.2: CON5.4 71.85,13.17 arc45 71.26,14.59 66.2,19.65 arc-45 65.7,20.87 v65.72,20.89 | CON18.4 | CON18.4 49.11,47.76 arc-63 v49.72,48.14
  Bottom 0.2: v49.72,48.14 v49.72,48.14 arc64 50.29,47.24 58.72,43.16 arc-64 65.27,32.71 65.27,21.76 arc45 65.56,21.05 v65.72,20.89
ETH_TX-  (via drill 0.5 pad 1)
  Top 0.2: CON5.3 70.6,13.82 arc45 70.01,15.24 64.42,20.83 v64.42,20.89 | CON18.3 48.02,48.39 arc-37 48.47,48.84 v48.77,48.99
  Bottom 0.2: v48.77,48.99 48.77,48.07 arc64 49.33,47.17 58.53,42.72 arc-64 64.87,32.59 64.87,21.76 arc-45 64.58,21.05 v64.42,20.89
FMU-!RESET
  Top 0.2: PAD27.P$1 118.57,79.59 97.02,79.59 arc90 96.02,78.59 CON1.7
FMU-CH1-PROT/MOTOR1  (via drill 0.5 pad 1)
  Top 0.2: v63.37,41.39 60.75,39.43 arc28 59.24,37.59 57.1,33.14 arc-47 55.14,31.43 54.07,31.09 PAD28.2 | CON1.50 85.52,69.36 arc-45 84.23,66.25 74.43,56.46 arc-45 70.9,54.99 63.37,54.99 v63.07,54.69
  Bottom 0.2: v63.07,54.69 arc-45 63.37,53.97 v63.37,41.39
FMU-CH2-PROT/MOTOR2  (via drill 0.5 pad 1)
  Top 0.2: CON1.52 85.02,69.22 arc-45 83.9,66.52 74.48,57.11 arc-45 70.95,55.64 48.22,55.64 arc-90 v45.57,58.29 | PAD29.2 42.07,68.99 arc-90 v43.07,67.99
  Bottom 0.2: v43.07,67.99 arc-90 45.57,65.49 v45.57,58.29
FMU-CH3-PROT/MOTOR3  (via drill 0.5 pad 1)
  Top 0.2: CON1.54 84.52,69.31 arc-45 84.23,68.6 v84.02,68.39 | PAD30.2 67.94,97.9 v76.31,84.14
  Bottom 0.2: v84.02,68.39 78.25,74.16 arc-45 76.31,78.84 v76.31,84.14
FMU-CH4-PROT/MOTOR4  (via drill 0.5 pad 1)
  Top 0.2: CON1.56 84.02,70.86 arc-45 83.73,70.15 v83.67,70.09 | v92.05,80.64 92.32,80.91 arc-45 94.44,81.79 106.84,81.79 arc58 115.31,86.48 118.94,92.26 PAD31.2
  Bottom 0.2: v92.05,80.64 91.93,80.52 arc-45 90.39,76.81 v83.67,70.09
FMU-CH5-PROT/MOTOR5  (via drill 0.5 pad 1)
  Top 0.2: CON1.58 83.52,71.86 arc-45 83.23,71.15 83.16,71.08 arc45 82.87,70.38 82.87,67.96 arc-45 82.58,67.25 82.41,67.08 arc45 82.12,66.38 v82.12,65.94 | v93.97,65.34 94.07,65.34 102.82,56.59 arc45 114.28,51.84 120.02,51.84 arc-45 127.36,48.8 130.06,46.11 arc45 132.26,45.19 PAD32.2
  Bottom 0.2: v93.97,65.34 83.57,65.34 arc-45 v82.12,65.94
FMU-CH6-PROT/MOTOR6  (via drill 0.5 pad 1)
  Top 0.2: v93.97,63.64 101.27,56.34 arc45 114.55,50.84 119.78,50.84 arc-45 127.02,47.84 133.09,41.77 arc-45 133.97,39.65 133.97,32.29 PAD33.2 | CON1.60 83.02,72.11 arc-45 82.73,71.4 82.71,71.38 arc45 82.42,70.68 82.42,68.21 arc-45 82.13,67.5 82.11,67.48 arc45 81.17,65.21 v81.17,65.04
  Bottom 0.2: v93.97,63.64 83.81,63.64 arc-45 81.69,64.52 v81.17,65.04
FMU-SWCLK
  Top 0.2: CON1.3 97.02,78.59 arc-90 97.42,78.99 115.73,78.99 arc-45 117.85,78.11 PAD25.P$1
FMU-SWDIO
  Top 0.2: CON1.1 97.52,78.39 113.4,78.39 arc-45 115.4,77.56 115.47,77.49 PAD26.P$1
GND  (via drill 0.5 pad 1)
  Top 0.2: CON19.B12 49.22,79.94 | 49.22,79.94 CON19.A1 | CON19.A12 54.72,79.99 | 54.72,79.99 CON19.B1 | CON19.P$2 54.72,79.99 | CON19.P$1 49.17,79.99 49.22,79.94 | CON1.55 84.02,78.68 84.03,78.69
  Top 0.3: 124.27,39.19 v123.97,39.19 | 102.77,39.19 v102.47,39.19 | 81.27,39.69 v80.97,39.69
  Top 0.5: 124.34,39.19 v123.97,39.19 | 102.84,39.19 v102.47,39.19 | 81.34,39.69 v80.97,39.69
  Top 0.6: IC5.7 124.34,39.19 | IC7.7 102.84,39.19 | IC2.7 81.34,39.69
  other vias: 119.67,30.99 119.67,29.99 119.67,28.99 119.67,27.99 119.67,26.99 119.67,31.99 123.97,37.79 125.97,39.19 125.97,37.79 129.67,35.39 129.67,34.19 128.47,35.39 117.87,47.69 117.87,48.79 117.87,49.89 118.97,49.89 120.07,49.89 127.97,30.99 127.97,29.99 127.97,28.99 127.97,27.99 127.97,26.99 127.97,31.99 98.17,30.99 98.17,29.99 98.17,28.99 98.17,27.99 98.17,26.99 98.17,31.99 102.47,37.79 104.47,39.19 104.47,37.79 108.17,35.39 108.17,34.19 106.97,35.39 96.37,47.69 96.37,48.79 96.37,49.89 97.47,49.89 98.57,49.89 106.47,30.99 106.47,29.99 106.47,28.99 106.47,27.99 106.47,26.99 106.47,31.99 68.97,24.69 69.97,24.69 70.97,24.69 71.97,24.69 72.97,24.69 73.97,24.69 74.97,24.69 75.97,24.69 76.97,24.69 67.97,24.69 80.97,38.29 82.97,39.69 82.97,38.29 86.67,35.89 86.67,34.69 85.47,35.89 74.87,48.19 74.87,49.29 74.87,50.39 75.97,50.39 77.07,50.39 84.97,31.49 84.97,30.49 84.97,29.49 84.97,28.49 84.97,27.49 84.97,32.49 58.57,44.29 59.67,43.79 60.77,43.29 59.02,45.29 60.12,44.84 99.12,102.09 99.12,100.69 98.62,104.39 95.92,104.39 104.52,102.29 104.52,100.89 79.77,105.34 79.17,100.34 139.17,32.89 55.67,60.49 40.92,81.19 45.17,78.24 138.82,54.49 138.12,69.39 131.97,72.64 61.22,44.34 135.17,33.59 135.07,37.69 141.77,48.39 137.37,48.29 117.17,95.79 114.97,91.99 63.97,98.99 66.27,94.99 34.67,67.29 39.07,67.29 54.87,25.59 56.97,29.99 90.97,70.49 79.47,69.49 76.47,68.99 73.97,66.49 76.47,63.99 84.47,57.49 81.97,54.99 79.27,53.79 71.47,56.49 49.47,53.19 48.97,58.99 58.52,64.49 44.47,59.99 41.47,61.49 106.47,16.99 106.47,20.69 57.87,80.29 55.67,71.49 61.87,78.89 83.47,79.39 86.77,71.19 70.57,53.69 94.42,55.89 95.97,59.24 107.87,54.89 107.22,58.19 97.32,68.19 100.07,70.74 102.07,74.44 113.92,77.14 122.62,64.24 121.97,92.99 93.87,79.79 117.07,82.99 94.92,79.79 90.82,81.49 87.17,83.94 83.07,95.24 101.02,87.39 92.77,102.04 52.07,90.79 58.97,75.84 62.72,74.49 57.22,67.79 56.82,37.34 59.27,33.29 62.42,13.19 93.27,15.44 83.97,14.84 75.22,20.54 77.57,17.29 68.77,20.49 102.22,14.79 105.42,10.39 111.72,10.39 112.42,20.44 126.92,51.54 124.17,60.69 115.87,64.24 70.82,17.19
  pour Top (rank 3): 58.12,23.4 53.58,25.49 arc-90 52.1,29.44 56.21,38.55 arc89 54.74,42.5 34.23,52.07 arc-65 32.5,54.79 32.5,69.01 arc-30 32.9,70.51 43.45,88.87 arc-30 44.55,89.97 75.75,107.99 arc-30 77.25,108.39 98.66,108.39 arc-31 100.19,107.97 131.42,89.47 arc-29 132.49,88.39 143.04,70.11 arc-30 143.44,68.61 143.44,35.19 arc-30 143.03,33.68 137.14,23.58 arc-60 134.55,22.09 116.27,22.09 arc90 113.27,19.09 113.27,6.09 59.87,6.09 59.87,20.67 arc65
  pour Bottom (rank 3): 59.92,6.19 59.92,20.67 arc65 58.17,23.4 53.58,25.51 arc-90 52.1,29.47 56.24,38.64 arc89 54.77,42.59 34.33,52.12 arc-65 32.6,54.84 32.6,69 arc-30 33,70.5 43.52,88.81 arc-30 44.62,89.92 75.93,107.99 arc-30 77.43,108.39 98.5,108.39 arc-31 100.02,107.97 131.24,89.47 arc-29 132.31,88.39 142.94,69.98 arc-30 143.34,68.48 143.34,34.38 137.1,23.68 arc-60 134.51,22.19 116.27,22.19 arc90 113.27,19.19 113.27,6.19
  pour Route3 (rank 3): 52.1,29.47 56.24,38.64 arc89 54.77,42.59 34.33,52.12 arc-65 32.6,54.84 32.6,69.8 43.92,89.51 75.93,107.99 arc-30 77.43,108.39 98.5,108.39 arc-31 100.02,107.97 131.24,89.47 arc-29 132.31,88.39 142.94,69.98 arc-30 143.34,68.48 143.34,35.19 arc-30 142.93,33.68 136.23,22.19 116.27,22.19 arc90 113.27,19.19 113.27,6.19 59.92,6.19 59.92,20.67 arc65 58.17,23.4 53.58,25.51 arc-90
I2C2_SCL
  Top 0.2: CON1.6 96.52,72.37 arc45 97.11,70.96 100.19,67.87 arc45 102.31,66.99 102.43,66.99 arc-45 104.55,66.11 107.29,63.37 arc45 109.17,62.59 122.77,62.59 | 122.77,62.59 arc90 126.77,66.59 126.77,67.36 arc45 125.6,70.19 CON15.3 | 122.77,62.59
I2C2_SDA
  Top 0.2: CON1.4 97.02,72.47 arc45 97.61,71.06 100.29,68.37 arc45 102.41,67.49 102.63,67.49 arc-45 104.75,66.61 107.49,63.87 arc45 109.61,62.99 122.47,62.99 arc90 125.47,65.99 CON15.4
IO-CH1-PROT
  Top 0.2: CON1.80 78.02,72.34 75.76,72.34 arc45 73.64,71.46 66.35,64.17 arc-45 64.23,63.29 56.51,63.29 arc45 54.39,62.41 50.82,58.84 arc45 CON16.2
IO-CH2-PROT
  Top 0.2: CON16.3 51.35,57.42 arc-45 52.22,59.55 54.59,61.91 arc-45 56.71,62.79 64.43,62.79 arc45 66.55,63.67 73.79,70.91 arc-45 75.91,71.79 78.02,71.79 arc90 78.52,72.29 CON1.78
IO-CH3-PROT
  Top 0.2: CON16.4 52.6,57.97 arc-45 53.47,60.1 54.79,61.41 arc-45 56.91,62.29 64.63,62.29 arc45 66.75,63.17 73.99,70.41 arc-45 76.11,71.29 78.02,71.29 arc90 79.02,72.29 CON1.76
IO-CH4-PROT
  Top 0.2: CON16.5 53.85,57.89 arc-90 54.35,58.39 56.67,58.39 arc90 58.17,59.89 arc-90 60.07,61.79 64.83,61.79 arc45 66.95,62.67 74.19,69.91 arc-45 76.31,70.79 78.02,70.79 arc90 79.52,72.29 CON1.74
IO-CH5-PROT
  Top 0.2: CON16.6 55.1,57.84 56.72,57.84 arc90 58.67,59.79 arc-90 60.17,61.29 65.03,61.29 arc45 67.15,62.17 74.39,69.41 arc-45 76.51,70.29 78.02,70.29 arc90 80.02,72.29 CON1.72
IO-CH7-PROT/24V_EN  (via drill 0.5 pad 1)
  Top 0.2: R6.1 84.55,33.54 84.6,33.49 86.77,33.49 arc90 87.77,34.49 87.77,46.22 arc45 86.8,48.56 81.32,54.04 arc-45 v80.72,55.49 | CON1.68 81.02,69.11 arc-45 80.73,68.4 79.21,66.88 arc45 77.87,63.64 v77.87,61.84
  Bottom 0.2: v80.72,55.49 80.72,56.92 arc45 79.26,60.46 v77.87,61.84
IO-CH8-PROT/12V_EN  (via drill 0.5 pad 1)
  Top 0.2: CON1.66 81.52,68.86 arc-45 81.23,68.15 80.16,67.08 arc45 79.22,64.81 v79.22,63.24 | v79.22,63.24 | R5.1 105.75,33.09 108.17,33.09 arc90 109.17,34.09 109.17,41.95 arc45 108.29,44.07 95.15,57.21 arc-45 94.42,58.97 v94.42,60.94
  Bottom 0.2: v79.22,63.24 80.06,62.41 arc45 83.59,60.94 v94.42,60.94
N$1
  Top 0.3: R18.2 LED4.A
N$2  (via drill 0.5 pad 1)
  other vias: 90.27,139.69 91.47,139.69 92.67,139.69 90.27,138.49 91.47,138.49 92.67,138.49 90.27,137.29 91.47,137.29 92.67,137.29 90.27,136.09 91.47,136.09 92.67,136.09 90.27,134.89 91.47,134.89 92.67,134.89 90.27,133.69 91.47,133.69 92.67,133.69
  pour Top (no thermals): 93.17,139.89 93.17,131.09 arc-90 92.87,130.79 90.07,130.79 arc-90 89.77,131.09 89.77,139.89 arc-90 90.07,140.19 92.87,140.19 arc-90
  pour Bottom (no thermals): 93.17,139.89 93.17,131.09 arc-90 92.87,130.79 90.07,130.79 arc-90 89.77,131.09 89.77,139.89 arc-90 90.07,140.19 92.87,140.19 arc-90
N$4  (via drill 0.5 pad 1)
  other vias: 165.88,93.49 166.48,92.45 167.08,91.41 164.84,92.89 165.44,91.85 166.04,90.81 163.8,92.29 164.4,91.25 165,90.21 162.76,91.69 163.36,90.65 163.96,89.61 161.72,91.09 162.32,90.05 162.92,89.01 160.68,90.49 161.28,89.45 161.88,88.41
  pour Top (no thermals): 167.5,91.08 159.88,86.68 arc-90 159.47,86.79 158.07,89.21 arc-90 158.18,89.62 165.8,94.02 arc-90 166.21,93.91 167.61,91.49 arc-90
  pour Bottom (no thermals): 167.5,91.08 159.88,86.68 arc-90 159.47,86.79 158.07,89.21 arc-90 158.18,89.62 165.8,94.02 arc-90 166.21,93.91 167.61,91.49 arc-90
N$6  (via drill 0.5 pad 1)
  other vias: 12.16,97.23 12.76,98.26 13.36,99.3 13.2,96.63 13.8,97.66 14.4,98.7 14.24,96.03 14.84,97.06 15.44,98.1 15.28,95.43 15.88,96.46 16.48,97.5 16.32,94.83 16.92,95.86 17.52,96.9 17.35,94.23 17.95,95.26 18.55,96.3
  pour Top (no thermals): 13.44,99.84 21.06,95.44 arc-90 21.17,95.03 19.77,92.6 arc-90 19.36,92.49 11.74,96.89 arc-90 11.63,97.3 13.03,99.73 arc-90
  pour Bottom (no thermals): 13.4,99.81 21.02,95.41 arc-90 21.13,95 19.73,92.57 arc-90 19.32,92.46 11.7,96.86 arc-90 11.59,97.27 12.99,99.7 arc-90
N$7  (via drill 0.5 pad 1)
  Top 0.3: v128.92,41.59 arc-90 129.55,40.97 129.55,40.44 R29.2
  Bottom 0.3: v128.92,41.59 124.47,41.59 arc90 116.47,33.59 v116.47,30.99
  pour Top (no thermals): 113.37,35.49 113.37,24.19 arc90 114.87,22.69 118.47,22.69 118.47,33.99 arc90 116.97,35.49
N$8
  Top 0.2: R2.2 57.37,72.24 SJ2.1
N$9  (via drill 0.5 pad 1)
  Top 0.2: R4.S2 v87.97,123.29 | IC1.4 95.17,105.34 95.17,106.29 v95.37,106.49
  Bottom 0.2: v87.97,123.29 arc-45 89.18,123.79 92.52,123.79 arc-90 95.77,120.54 95.77,107.46 arc-45 v95.37,106.49
N$10  (via drill 0.5 pad 1)
  Top 0.2: R4.S1 v87.97,124.59 | IC1.3 96.77,105.34 96.77,106.29 v96.57,106.49
  Bottom 0.2: 87.97,124.55 arc45 88.84,124.19 92.52,124.19 arc-90 96.17,120.54 96.17,107.46 arc45 v96.57,106.49
  Bottom 0.3: 87.97,124.55 v87.97,124.59
N$11
  Top 0.2: IC7.3 104.11,33.44 R5.2
N$12
  Top 0.2: R15.2 R14.1
N$14
  Top 0.6: C2.1 78.57,38.27 80.07,36.77 IC2.1
N$15
  pour Top (no thermals): 80.22,42.99 75.47,42.99 arc-90 73.47,44.99 73.47,47.49 arc90 71.47,49.49 69.97,49.49 arc90 67.97,47.49 67.97,41.49 arc90 69.97,39.49 78.97,39.49 78.97,40.34 arc-90 79.47,40.84 80.22,40.84
N$16
  Top 0.3: R9.2 85.25,36.99 83.88,36.99 IC2.4
N$17
  Top 0.2: IC2.3 82.61,34.95 arc45 82.9,34.24 83.1,34.04 R6.2
N$18
  Top 0.3: C15.2 R10.2 82.61,43.63 IC2.6
N$19
  Top 0.3: R10.1 C14.2
N$20
  Top 0.3: IC2.5 83.88,42.09 R11.1 R17.2 R12.2
N$21
  Top 0.2: LED1.A R7.2
N$22
  Top 0.2: LED2.A R8.2
N$23
  Top 0.2: LED3.A R16.2
N$35
  Top 0.6: C37.1 121.57,37.77 123.07,36.27 IC5.1
N$36
  pour Top (no thermals): 123.22,42.19 118.97,42.19 arc-90 116.97,44.19 116.97,46.99 arc90 114.97,48.99 112.77,48.99 112.77,40.99 arc90 114.77,38.99 121.97,38.99 121.97,39.84 arc-90 122.47,40.34 123.22,40.34
N$37
  Top 0.3: R27.2 128.25,36.49 126.88,36.49 IC5.4
N$39
  Top 0.3: C42.2 R28.2 125.61,43.13 IC5.6
N$40
  Top 0.3: R28.1 C41.2
N$41
  Top 0.3: IC5.5 126.88,40.49 128.05,40.49 R29.1 R30.2
N$49
  Top 0.6: C55.1 100.07,37.77 101.57,36.27 IC7.1
N$50
  pour Top (no thermals): 101.72,42.19 97.47,42.19 arc-90 95.47,44.19 95.47,46.99 arc90 93.47,48.99 91.27,48.99 91.27,40.99 arc90 93.27,38.99 100.47,38.99 100.47,39.84 arc-90 100.97,40.34 101.72,40.34
N$51
  Top 0.3: R39.2 106.75,36.49 105.38,36.49 IC7.4
N$53
  Top 0.3: C60.2 R40.2 104.11,43.13 IC7.6
N$54
  Top 0.3: R40.1 C59.2
N$55
  Top 0.3: IC7.5 105.38,40.49 106.55,40.49 R41.1 R42.2
OTG_DM1  (via drill 0.5 pad 1)
  Top 0.2: CON1.33 89.52,78.79 arc90 86.52,81.79 61.42,81.79 arc-45 59.3,82.67 57.57,84.41 arc45 56.15,84.99 CON14.4 55.38,84.99 52.81,82.42 arc45 52.22,81 CON19.A7 | CON19.B7 51.72,78.86 arc-45 51.43,78.15 v51.07,77.79
  Bottom 0.2: v51.07,77.79 51.68,78.4 arc45 51.97,79.11 51.97,85.08 arc-45 52.26,85.78 52.32,85.84 arc-90 54.93,85.84 CON14.4
OTG_DP1  (via drill 0.5 pad 1)
  Top 0.2: CON1.31 90.02,78.69 arc90 86.52,82.19 61.61,82.19 arc-45 59.49,83.07 56.82,85.74 arc90 53.99,85.74 CON14.3 53.24,84.32 arc-45 52.65,82.91 52.31,82.56 arc45 51.72,81.14 CON19.A6 | CON19.B6 52.22,77.84 v52.27,77.79
  Bottom 0.2: v52.27,77.79 52.37,77.89 52.37,83.71 arc-45 52.66,84.41 CON14.3
PGND  (via drill 0.5 pad 1)
  other vias: 21.27,60.79 21.27,62.09 21.27,59.49 19.97,60.79 19.97,62.09 19.97,59.49 18.67,60.79 18.67,62.09 18.67,59.49 17.37,60.79 17.37,62.09 17.37,59.49 21.27,58.19 19.97,58.19 18.67,58.19 17.37,58.19 21.27,63.39 19.97,63.39 18.67,63.39 17.37,63.39 51.97,107.21 50.84,106.56 53.1,107.86 51.32,108.33 50.19,107.68 52.45,108.98 50.67,109.46 49.54,108.81 51.8,110.11 50.02,110.58 48.89,109.93 51.15,111.23 54.22,108.51 53.57,109.63 52.92,110.76 52.27,111.88 49.72,105.91 49.07,107.03 48.42,108.16 47.77,109.28 118.77,110.21 117.64,110.86 119.9,109.56 119.42,111.33 118.29,111.98 120.55,110.68 120.07,112.46 118.94,113.11 121.2,111.81 120.72,113.58 119.59,114.23 121.85,112.93 121.02,108.91 121.67,110.03 122.32,111.16 122.97,112.28 116.52,111.51 117.17,112.63 117.82,113.76 118.47,114.88 154.62,53.89 154.62,52.59 154.62,55.19 155.92,53.89 155.92,52.59 155.92,55.19 157.22,53.89 157.22,52.59 157.22,55.19 158.52,53.89 158.52,52.59 158.52,55.19 154.62,56.49 155.92,56.49 157.22,56.49 158.52,56.49 154.62,51.29 155.92,51.29 157.22,51.29 158.52,51.29 144.59,22.84 143.46,23.49 145.71,22.19 143.94,21.72 142.81,22.37 145.06,21.07 143.29,20.59 142.16,21.24 144.41,19.94 142.64,19.47 141.51,20.12 143.76,18.82 146.84,21.54 146.19,20.42 145.54,19.29 144.89,18.17 142.33,24.14 141.68,23.02 141.03,21.89 140.38,20.77 42.88,35.57 41.71,36.12 44.06,35.02 42.33,34.39 41.16,34.94 43.51,33.84 41.79,33.21 40.61,33.76 42.96,32.66 41.24,32.04 40.06,32.58 42.41,31.49 45.24,34.47 44.69,33.29 44.14,32.11 43.59,30.94 40.53,36.67 39.98,35.49 39.43,34.31 38.88,33.13 10.03,33.12 8.86,33.67 11.21,32.57 9.48,31.94 8.31,32.49 10.66,31.39 8.94,30.76 7.76,31.31 10.11,30.21 8.39,29.59 7.21,30.13 9.56,29.04 12.39,32.02 11.84,30.84 11.29,29.66 10.74,28.49 7.68,34.22 7.13,33.04 6.58,31.86 6.03,30.68 116.97,10.64 115.67,10.64 118.27,10.64 116.97,9.34 115.67,9.34 118.27,9.34 116.97,8.04 115.67,8.04 118.27,8.04 116.97,6.74 115.67,6.74 118.27,6.74 119.57,10.64 119.57,9.34 119.57,8.04 119.57,6.74 115.67,11.94 116.97,11.94 118.27,11.94 119.57,11.94 164.83,14.75 164.18,13.62 165.48,15.88 165.96,14.1 165.31,12.97 166.61,15.23 167.08,13.45 166.43,12.32 167.73,14.58 168.21,12.8 167.56,11.67 168.86,13.93 166.13,17 167.26,16.35 168.38,15.7 169.51,15.05 163.53,12.5 164.66,11.85 165.78,11.2 166.91,10.55
  pour Top (rank 2, no thermals): 0.52,77.29 0.52,35.67 arc65 3.41,31.14 55.01,7.07 arc25 58.62,6.28 58.62,20.05 arc65 56.89,22.77 16.95,41.38 arc-65 15.22,44.1 15.22,73.32
  pour Top (rank 2, no thermals): 134.8,21.18 117.49,21.18 arc90 114.47,18.19 114.47,6.19 128.77,6.19 arc-30 134.02,4.77 135.33,4.02 arc90 169.48,13.17 174.77,22.33 arc30 175.44,24.84 175.42,35.76 175.42,77.34 160.42,73.39 160.42,35.76 160.44,28.32 arc-30 160.04,26.81 152.99,14.61 arc-90 148.89,13.51 136.3,20.78 arc30
  pour Bottom (rank 2): 55.01,7.07 3.41,31.14 arc-65 0.52,35.67 0.52,77.69 arc-30 0.92,79.19 19.75,111.83 arc-30 21.58,113.66 66.89,139.82 arc-30 69.39,140.49 106.55,140.49 arc-30 109.05,139.82 154.36,113.66 arc-30 156.19,111.83 174.75,79.65 arc-30 175.42,77.15 175.42,35.76 175.44,24.84 arc-30 174.77,22.33 169.48,13.17 arc-90 135.33,4.02 134.02,4.77 arc30 128.77,6.19 114.47,6.19 114.47,18.19 arc-90 117.47,21.19 135.24,21.19 arc60 137.84,22.69 144.04,33.41 arc30 144.44,34.91 144.44,69.38 arc30 144.04,70.88 133.23,89.6 arc30 132.13,90.7 100.28,109.09 arc30 98.78,109.49 77.16,109.49 arc30 75.66,109.09 43.81,90.7 arc30 42.71,89.6 31.9,70.88 arc30 31.5,69.38 31.5,54.15 arc65 33.23,51.43 52.85,42.28 arc-90 54.3,38.3 48.77,26.48 56.87,22.75 arc-65 58.62,20.03 58.62,6.28 arc-25
  pour Top (no thermals): 16.57,63.79 16.57,57.79 25.97,57.79 25.97,63.79
  pour Top (no thermals): 51.72,101.64 56.92,104.64 52.22,112.78 47.02,109.78
  pour Top (no thermals): 113.82,107.64 119.02,104.64 123.72,112.78 118.52,115.78
  pour Top (no thermals): 159.32,50.89 159.32,56.89 149.92,56.89 149.92,50.89
  pour Top (no thermals): 139.64,20.27 144.83,17.27 149.53,25.41 144.34,28.41
  pour Top (no thermals): 38.33,32.93 43.99,30.29 47.93,38.75 42.27,41.39
  pour Top (no thermals): 5.41,30.31 10.85,27.78 14.74,36.11 9.3,38.65
  pour Route2: 55.01,7.07 3.41,31.14 arc-65 0.52,35.67 0.52,77.69 arc-30 0.92,79.19 19.75,111.83 arc-30 21.58,113.66 66.89,139.82 arc-30 69.39,140.49 106.55,140.49 arc-30 109.05,139.82 154.36,113.66 arc-30 156.19,111.83 174.75,79.65 arc-30 175.42,77.15 175.42,35.76 175.44,24.84 arc-30 174.77,22.33 169.48,13.17 arc-90 135.33,4.02 134.02,4.77 arc30 128.77,6.19 114.47,6.19 114.47,18.19 arc-90 117.47,21.19 135.24,21.19 arc60 137.84,22.69 144.04,33.41 arc30 144.44,34.91 144.44,69.38 arc30 144.04,70.88 133.23,89.6 arc30 132.13,90.7 100.28,109.09 arc30 98.78,109.49 77.16,109.49 arc30 75.66,109.09 43.81,90.7 arc30 42.71,89.6 31.9,70.88 arc30 31.5,69.38 31.5,54.15 arc65 33.23,51.43 53.29,42.08 arc-90 54.74,38.09 50.5,29.01 arc90 51.96,25.01 56.87,22.75 arc-65 58.62,20.03 58.62,6.28 arc-25
  pour Route3 (no thermals): 0.52,77.29 0.52,35.67 arc65 3.41,31.14 55.01,7.07 arc25 58.62,6.28 58.62,20.05 arc65 56.89,22.77 16.95,41.38 arc-65 15.22,44.1 15.22,73.32
  pour Route3 (no thermals): 135.6,21.18 117.47,21.19 arc90 114.47,18.19 114.47,6.19 128.77,6.19 arc-30 134.02,4.77 135.33,4.02 arc90 169.48,13.17 174.77,22.33 arc30 175.44,24.84 175.42,35.76 175.42,77.34 160.42,73.39 160.42,35.76 160.44,28.32 arc-30 160.04,26.81 152.99,14.61 arc-90 148.89,13.51
PPM-SBUS-PROT  (via drill 0.5 pad 1)
  Top 0.2: CON2.3 80.22,13.41 arc-45 80.81,14.83 88.08,22.11 arc45 88.67,23.52 88.67,47.18 arc45 87.82,49.25 84.33,52.73 arc-45 82.87,56.26 v82.87,57.84 | CON1.62 82.52,72.36 arc-45 82.23,71.65 arc45 81.97,71.03 81.97,68.56 arc-45 81.68,67.85 81.16,67.33 arc45 80.22,65.06 v80.22,64.14 | v80.22,64.14
  Bottom 0.2: v82.87,57.84 arc45 82.62,58.44 78.58,62.48 arc-90 78.58,63.9 arc-45 79.16,64.14 v80.22,64.14
SERIAL1_RX
  Top 0.2: CON1.38 88.52,69.81 arc-45 87.06,66.28 74.13,53.36 arc-45 70.6,51.89 55.77,51.89 arc63 53.09,50.24 50.85,45.76 CON18.6
SERIAL1_TX
  Top 0.2: CON1.40 88.02,70.01 arc-45 86.56,66.48 73.93,53.86 arc-45 70.4,52.39 54.61,52.39 arc64 51.91,50.7 49.72,46.2 CON18.5
SERIAL2_RX
  Top 0.2: CON1.34 89.52,69.41 arc-45 88.06,65.88 74.53,52.36 arc-45 71,50.89 58.01,50.89 arc65 55.24,49.14 CON18.8
SERIAL2_TX
  Top 0.2: CON1.36 89.02,69.61 arc-45 87.56,66.08 74.33,52.86 arc-45 70.8,51.39 56.9,51.39 arc63 54.23,49.75 53.17,47.67 CON18.7
SERIAL3_RX
  Top 0.2: CON1.20 93.02,54.83 arc-45 92.14,52.71 91.05,51.62 arc45 90.17,49.5 90.17,17.09 90.17,17.02 90.17,14.35 arc-45 89.85,13.57 CON4.4
SERIAL3_TX
  Top 0.2: CON1.22 92.52,54.88 arc-45 91.71,52.93 90.65,51.87 arc45 89.77,49.75 89.77,15.21 arc-45 89.33,14.15 88.6,13.42 CON4.3
SERIAL4_RX
  Top 0.2: CON1.16 94.02,70.05 arc45 95.79,65.77 101.95,59.61 arc45 109.12,56.64 117.6,56.64 CON13.4
SERIAL4_TX
  Top 0.2: CON1.18 93.52,70.04 arc45 95.39,65.52 101.7,59.21 arc45 109.11,56.14 117.76,56.14 arc45 118.46,56.43 118.85,56.82 CON13.3
SERIAL5_RX  (via drill 0.5 pad 1)
  Top 0.2: CON1.12 95.02,72.32 arc45 95.61,70.91 v96.27,70.24 | v71.57,73.39 arc-45 70.6,72.99 67.96,72.99 arc45 62.43,70.7 57.21,65.48 arc-45 55.67,64.84 53.85,64.84 CON17.4
  Bottom 0.2: v96.27,70.24 96.27,70.04 arc-90 93.27,67.04 77.57,67.04 arc-90 71.57,73.04 v71.57,73.39
SERIAL5_TX  (via drill 0.5 pad 1)
  Top 0.2: CON1.14 94.52,71.21 arc45 v94.92,70.24 | v72.97,73.39 72.33,74.03 arc90 70.91,74.03 70.66,73.78 arc-45 69.96,73.49 67.81,73.49 arc45 62.28,71.2 57.16,66.08 arc-45 55.74,65.49 53.1,65.49 arc90 52.6,64.99 CON17.3
  Bottom 0.2: v94.92,70.24 94.92,69.99 arc-90 92.42,67.49 77.97,67.49 arc-90 72.97,72.49 v72.97,73.39
VBAT  (via drill 0.5 pad 1)
  Top 0.2: R14.2 100.47,104.62 100.32,104.77 arc45 100.2,105.07 v98.77,106.49
  Bottom 0.2: v98.77,106.49 v98.77,125.99
  other vias: 8.64,91.13 9.24,92.17 9.84,93.21 9.68,90.53 10.28,91.57 10.88,92.61 10.72,89.93 11.32,90.97 11.92,92.01 11.76,89.33 12.36,90.37 12.96,91.41 12.8,88.73 13.4,89.77 14,90.81 13.84,88.13 14.44,89.17 15.04,90.21 14.88,87.53 15.48,88.57 16.08,89.61 15.91,86.93 16.51,87.97 17.11,89.01 162.35,99.55 162.95,98.51 163.55,97.47 161.31,98.95 161.91,97.91 162.51,96.87 160.27,98.35 160.87,97.31 161.47,96.27 159.23,97.75 159.83,96.71 160.43,95.67 158.19,97.15 158.79,96.11 159.39,95.07 157.15,96.55 157.75,95.51 158.35,94.47 156.11,95.95 156.71,94.91 157.31,93.87 155.08,95.35 155.68,94.31 156.28,93.27 85.67,131.29 84.47,131.29 83.27,131.29 85.67,132.49 84.47,132.49 83.27,132.49 85.67,133.69 84.47,133.69 83.27,133.69 85.67,134.89 84.47,134.89 83.27,134.89 85.67,136.09 84.47,136.09 83.27,136.09 85.67,137.29 84.47,137.29 83.27,137.29 85.67,138.49 84.47,138.49 83.27,138.49 85.67,139.69 84.47,139.69 83.27,139.69 91.97,126.99 91.97,127.99 91.97,128.99 92.97,128.99 92.97,126.99 92.97,127.99 82.97,126.99 82.97,127.99 82.97,128.99 83.97,128.99 83.97,126.99 83.97,127.99
  pour Top (rank 2, no thermals): 15.5,74.47 0.5,78.49 19.75,111.83 arc-30 21.58,113.66 66.89,139.82 arc-30 69.39,140.49 106.55,140.49 arc-30 109.05,139.82 154.36,113.66 arc-30 156.19,111.83 175.44,78.49 160.44,74.47 144.54,102.01 104.57,125.09 arc30 103.07,125.49 72.87,125.49 arc30 71.37,125.09 32.1,102.42 arc30 31,101.32
  pour Route3 (no thermals): 15.5,74.47 0.5,78.49 19.75,111.83 arc-30 21.58,113.66 66.89,139.82 arc-30 69.39,140.49 106.55,140.49 arc-30 109.05,139.82 154.36,113.66 arc-30 156.19,111.83 175.44,78.49 160.44,74.47 144.94,101.32 arc30 143.84,102.42 104.57,125.09 arc30 103.07,125.49 72.87,125.49 arc30 71.37,125.09 32.1,102.42 arc30 31,101.32
VBUS  (via drill 0.5 pad 1)
  Top 0.2: CON1.29 90.53,78.6 arc90 86.49,82.63 61.81,82.63 arc-45 59.69,83.51 57.29,85.91 arc45 55.17,86.79 50.8,86.79 50.7,86.69
  Top 0.3: CON19.B4 53.22,78.4 arc45 v53.47,77.79 | D1.A 50.7,87.69 50.7,86.69 CON14.2 50.72,84.97 CON19.A4
  Bottom 0.5: v53.47,77.79 53.47,77.69 arc-90 52.47,76.69 51.07,76.69 arc-90 50.07,77.69 50.07,79.02 arc-45 50.26,79.48 50.41,79.63 arc45 50.7,80.34 CON14.2
VDC  (via drill 0.5 pad 1)
  Top 0.3: M2.1 28.47,53.79 28.47,53.89
  Route3 1: v124.67,26.19 v124.67,23.19 | v103.17,26.19 v103.17,23.19 v124.67,23.19 | v81.67,26.59 v81.67,23.59 81.67,22.04 arc-90 78.67,19.04 61.51,19.04 arc-45 55.29,21.62 48.32,28.59 | v124.67,23.19 133.98,23.19 arc-28 135.39,22.84 138.67,21.09
  other vias: 103.07,30.99 81.67,24.59 81.67,25.59 103.17,24.19 103.17,25.19 124.67,24.19 124.67,25.19 17.07,52.59 17.07,53.79 17.07,54.99 18.27,52.59 18.27,53.79 18.27,54.99 19.47,52.59 19.47,53.79 19.47,54.99 20.67,52.59 20.67,53.79 20.67,54.99 21.87,52.59 21.87,53.79 21.87,54.99 23.07,52.59 23.07,53.79 23.07,54.99 24.27,52.59 24.27,53.79 24.27,54.99 25.47,52.59 25.47,53.79 25.47,54.99 42.78,106.78 43.81,107.38 44.85,107.98 43.38,105.74 44.41,106.34 45.45,106.94 43.98,104.7 45.01,105.3 46.05,105.9 44.58,103.66 45.61,104.26 46.65,104.86 45.18,102.62 46.21,103.22 47.25,103.82 45.78,101.58 46.81,102.18 47.85,102.78 46.38,100.55 47.41,101.15 48.45,101.75 46.98,99.51 48.01,100.11 49.05,100.71 48.65,28.69 47.56,29.2 46.48,29.7 49.16,29.78 48.07,30.28 46.98,30.79 49.66,30.86 48.58,31.37 47.49,31.88 50.17,31.95 49.08,32.46 48,32.97 50.68,33.04 49.59,33.55 48.5,34.05 51.19,34.13 50.1,34.63 49.01,35.14 51.69,35.21 50.61,35.72 49.52,36.23 52.2,36.3 51.11,36.81 50.03,37.32 111.64,109.46 110.6,110.06 109.56,110.66 112.24,110.5 111.2,111.1 110.16,111.7 112.84,111.54 111.8,112.14 110.76,112.74 113.44,112.58 112.4,113.18 111.36,113.78 114.04,113.62 113,114.22 111.96,114.82 114.64,114.66 113.6,115.26 112.56,115.86 115.24,115.7 114.2,116.3 113.16,116.9 115.84,116.74 114.8,117.34 113.76,117.94 150.47,59.69 150.47,60.89 150.47,62.09 151.67,59.69 151.67,60.89 151.67,62.09 152.87,59.69 152.87,60.89 152.87,62.09 154.07,59.69 154.07,60.89 154.07,62.09 155.27,59.69 155.27,60.89 155.27,62.09 156.47,59.69 156.47,60.89 156.47,62.09 157.67,59.69 157.67,60.89 157.67,62.09 158.87,59.69 158.87,60.89 158.87,62.09 149.59,15.07 148.56,15.67 147.52,16.27 150.19,16.11 149.16,16.71 148.12,17.31 150.79,17.15 149.76,17.75 148.72,18.35 151.39,18.19 150.36,18.79 149.32,19.39 151.99,19.23 150.96,19.83 149.92,20.43 152.59,20.27 151.56,20.87 150.52,21.47 153.19,21.31 152.16,21.91 151.12,22.51 153.79,22.35 152.76,22.95 151.72,23.55 83.97,120.99 83.97,119.99 83.97,118.99 83.97,117.99 83.97,116.99 84.97,116.99 85.97,116.99 86.97,116.99 87.97,116.99 89.97,116.99 88.97,116.99 91.97,116.99 90.97,116.99 91.97,117.99 91.97,118.99 91.97,119.99 91.97,120.99
  pour Top (rank 2, no thermals): 31.83,100.64 16.7,74.44 arc30 16.3,72.94 16.3,44.67 arc65 18.03,41.96 49.2,27.42 54.29,38.27 arc90 52.85,42.26 33.23,51.43 arc-65 31.5,54.15 31.5,69.38 arc-30 31.9,70.88 42.71,89.6 arc-30 43.81,90.7 75.66,109.09 arc-30 77.16,109.49 98.78,109.49 arc-30 100.28,109.09 132.13,90.7 arc-30 133.23,89.6 144.04,70.88 arc-30 144.44,69.38 144.44,34.91 arc-30 144.04,33.41 137.13,21.45 148.52,14.88 arc90 152.62,15.97 159.04,27.09 arc30 159.44,28.59 159.44,73.4 arc30 159.04,74.9 144.21,100.59 arc30 143.11,101.68 104.3,124.09 arc30 102.8,124.49 73.14,124.49 arc30 71.64,124.09 32.93,101.74 arc30
  pour Top (no thermals): 81.12,37.04 81.12,33.74 80.07,32.69 80.07,22.99 82.17,22.99 82.17,33.19 81.6,33.76 81.62,37.04
  pour Top (no thermals): 102.62,36.54 102.62,33.24 101.57,32.19 101.57,22.49 103.67,22.49 103.67,32.69 103.1,33.26 103.12,36.54
  pour Top (no thermals): 124.12,36.54 124.12,33.74 123.07,32.69 123.07,22.49 125.17,22.49 125.17,33.19 124.61,33.76 124.62,36.54
  pour Route3 (rank 2, no thermals): 32.43,100.99 16.7,73.75 arc30 16.3,72.25 16.3,44.67 arc65 18.03,41.96 49.19,27.42 54.28,38.27 arc90 52.83,42.26 33.23,51.43 arc-65 31.5,54.15 31.5,69.38 arc-30 31.9,70.88 42.71,89.6 arc-30 43.81,90.7 75.66,109.09 arc-30 77.16,109.49 98.78,109.49 arc-30 100.28,109.09 132.13,90.7 arc-30 133.23,89.6 144.04,70.88 arc-30 144.44,69.38 144.44,34.91 arc-30 144.04,33.41 137.13,21.45 148.52,14.88 arc90 152.62,15.97 159.04,27.09 arc30 159.44,28.59 159.44,73.4 arc30 159.04,74.9 144.21,100.59 arc30 143.11,101.68 104.3,124.09 arc30 102.8,124.49 73.14,124.49 arc30 71.64,124.09 33.53,102.08 arc30
VDD_5V  (via drill 0.5 pad 1)
  Top 0.2: v95.27,100.69 95.3,100.72 95.3,101.99 C1.2 95.15,102.24 95.15,103.27 94.97,103.44 IC1.5 | CON10.1 41.63,54.39 | 131.35,66.22 v131.37,66.24 | 131.35,59.17 v131.37,59.19 | 120.1,59.17 v120.12,59.19 | R16.1 104.3,18.62 v104.27,18.59 | CON17.2 51.37,64.07 | R18.1 v123.57,65.69
  Top 0.5: CON7.1 75.4,100.29 v75.37,100.29 | CON9.1 v130.32,77.99 | CON12.1 v136.37,38.84 | CON8.1 v110.25,20.64 | CON4.2 v87.35,11.29 | CON2.2 v78.97,11.22 | CON11.1 v43.27,74.99 | CON20.1 v50.07,69.39 | 41.63,54.39 v40.87,52.89 | CON21.1 131.35,66.22 | CON6.1 131.35,59.17 | CON13.2 120.1,59.17 | 51.37,64.07 v51.37,62.29
  other vias: 81.07,79.39 82.07,79.39 80.07,79.39 110.17,30.49 112.37,29.39 111.27,29.39 110.17,29.39 110.17,28.29 111.27,28.29 112.37,28.29 118.97,70.99 55.27,87.69 56.37,87.69 57.47,87.69
  pour Top (no thermals): 79.62,79.79 79.62,78.99 81.47,78.99 arc-90 81.97,78.49 81.97,77.59 82.57,77.59 82.57,79.79
  pour Route2 (rank 3): 52.15,29.44 56.29,38.62 arc89 54.82,42.57 34.33,52.12 arc-65 32.6,54.84 32.6,69 arc-30 33,70.5 43.52,88.81 arc-30 44.62,89.92 75.93,107.99 arc-30 77.43,108.39 98.5,108.39 arc-31 100.02,107.97 131.24,89.47 arc-29 132.31,88.39 142.94,69.98 arc-30 143.34,68.48 143.34,35.19 arc-30 142.93,33.68 137.1,23.68 arc-60 134.51,22.19 116.27,22.19 arc90 113.27,19.19 113.27,6.19 59.82,6.19 59.82,20.72 arc65 58.07,23.44 53.63,25.49 arc-90
  pour Top (no thermals): 112.97,31.69 109.67,31.69 109.67,27.89 112.97,27.89
  pour Top (no thermals): 53.07,88.09 53.07,87.29 57.87,87.29 57.87,88.09
VDD_12V  (via drill 0.5 pad 1)
  Top 0.3: v107.42,41.59 arc-90 108.05,40.97 108.05,40.44 R41.2
  Bottom 0.3: v107.42,41.59 102.97,41.59 arc90 94.97,33.59 v94.97,31.99
  pour Top (no thermals): 91.87,35.49 91.87,23.39 96.97,23.39 96.97,33.99 arc90 95.47,35.49
  pour Top (no thermals): 98.87,12.09 97.07,12.09 97.07,15.85 arc45 96.19,17.97 92.46,21.71 arc-45 91.87,23.12 91.87,24.39 96.97,24.39 96.97,22.33 arc45 97.85,20.21 97.99,20.07 arc-45 98.87,17.95
VDD_24V  (via drill 0.5 pad 1)
  Top 0.2: R8.1 79.25,26.29 arc90 78.45,27.09 76.97,27.09 C16.P$2
  Top 0.3: v85.92,43.59 86.18,43.33 arc-45 86.55,42.45 86.55,42.24 R11.2 | PAD17.P$1 62.07,29.99 C18.P$2
  Top 0.5: CON18.9 CON18.10 CON18.11
  Top 2: L4.2 68.57,31.37 66.73,33.2 arc-45 65.67,35.77 65.67,44.49 arc64 64.54,46.29 58.17,49.39
  Bottom 0.3: v85.92,43.59 82.97,43.59 arc90 74.67,35.29 v74.67,32.49
  pour Top (no thermals): 61.47,30.49 61.47,27.09 78.47,27.09 78.47,30.49 76.97,30.49 arc-90 75.47,31.99 arc90 73.97,33.49 67.97,33.49 arc90 66.47,31.99 arc-90 64.97,30.49
  pour Top (no thermals): 59.99,49.54 56.55,42.17 53.66,43.52 56.38,49.34 arc-90 58.65,50.17

## Text on the board
tPlace: + | - | BAT1H | + | - | - | M4PWR | + | SMBCAN | - | + | M3PWR | + | - | - | M3PWM | + | BAT2H | + | BAT3H | - | SMBCAN | M4PWM | RST | CLK | CAN1 | FMU_DEBUG | DIO | I2C | + | 5V | SMBCAN | GND | M2PWM | BEACON | - | + | - | AUX | CAN2 | BKP UART | M2PWR | SMBCAN | M5PWR | - | PAYLOAD | + | - | M5PWM | + | M1PWR | BAT2L | SMBCAN | - | M1PWM | - | M6PWR | + | + | + | - | M6PWM | - | BAT3L | + | 24V | 12V | 5V | BAT1L | ETH | SBUS | Telem | 12V | + | SMBCAN | - | - | +
bPlace: GND | 5V | SCL | SDA | Pads marked with dotted lines / should be connected / with 16 AWG wire or thicker
Document: 5V | CAH2_H | CAN2_L | GND | GND | CAN2_L | 5V | CAH2_H | CAH2_H | CAN2_L | 5V | GND | 5V | CAN1_H | CAN1_L | GND | GND | 5V | SER5_TX | SER5_RX | GND | CAN2_L | CAH2_H | 5V | GND | AUX1 | AUX2 | AUX3 | AUX4 | AUX5 | SER4_RX | SER4_TX | 5V | GND | GND | CAN2_L | CAH2_H | 5V | GND | CAN2_L | CAH2_H | 5V | ETH_RX- | ETH_RX+ | ETH_TX- | ETH_TX+ | SER1_TX | SER1_RX | SER2_TX | SER2_RX | 24V | 24V | 24V | GND | GND | GND | 5V | CAH2_H | CAN2_L | GND | GND | CAN2_L | CAH2_H | 5V | ETH_RX- | ETH_RX+ | ETH_TX- | ETH_TX+ | GND | 5V | SBUS | GND | 5V | SER3_TX | SER3_RX | GND | 12V | 12V | GND